# Altium project YL-LPC4350-CORE-V1.0 .PRJPCB
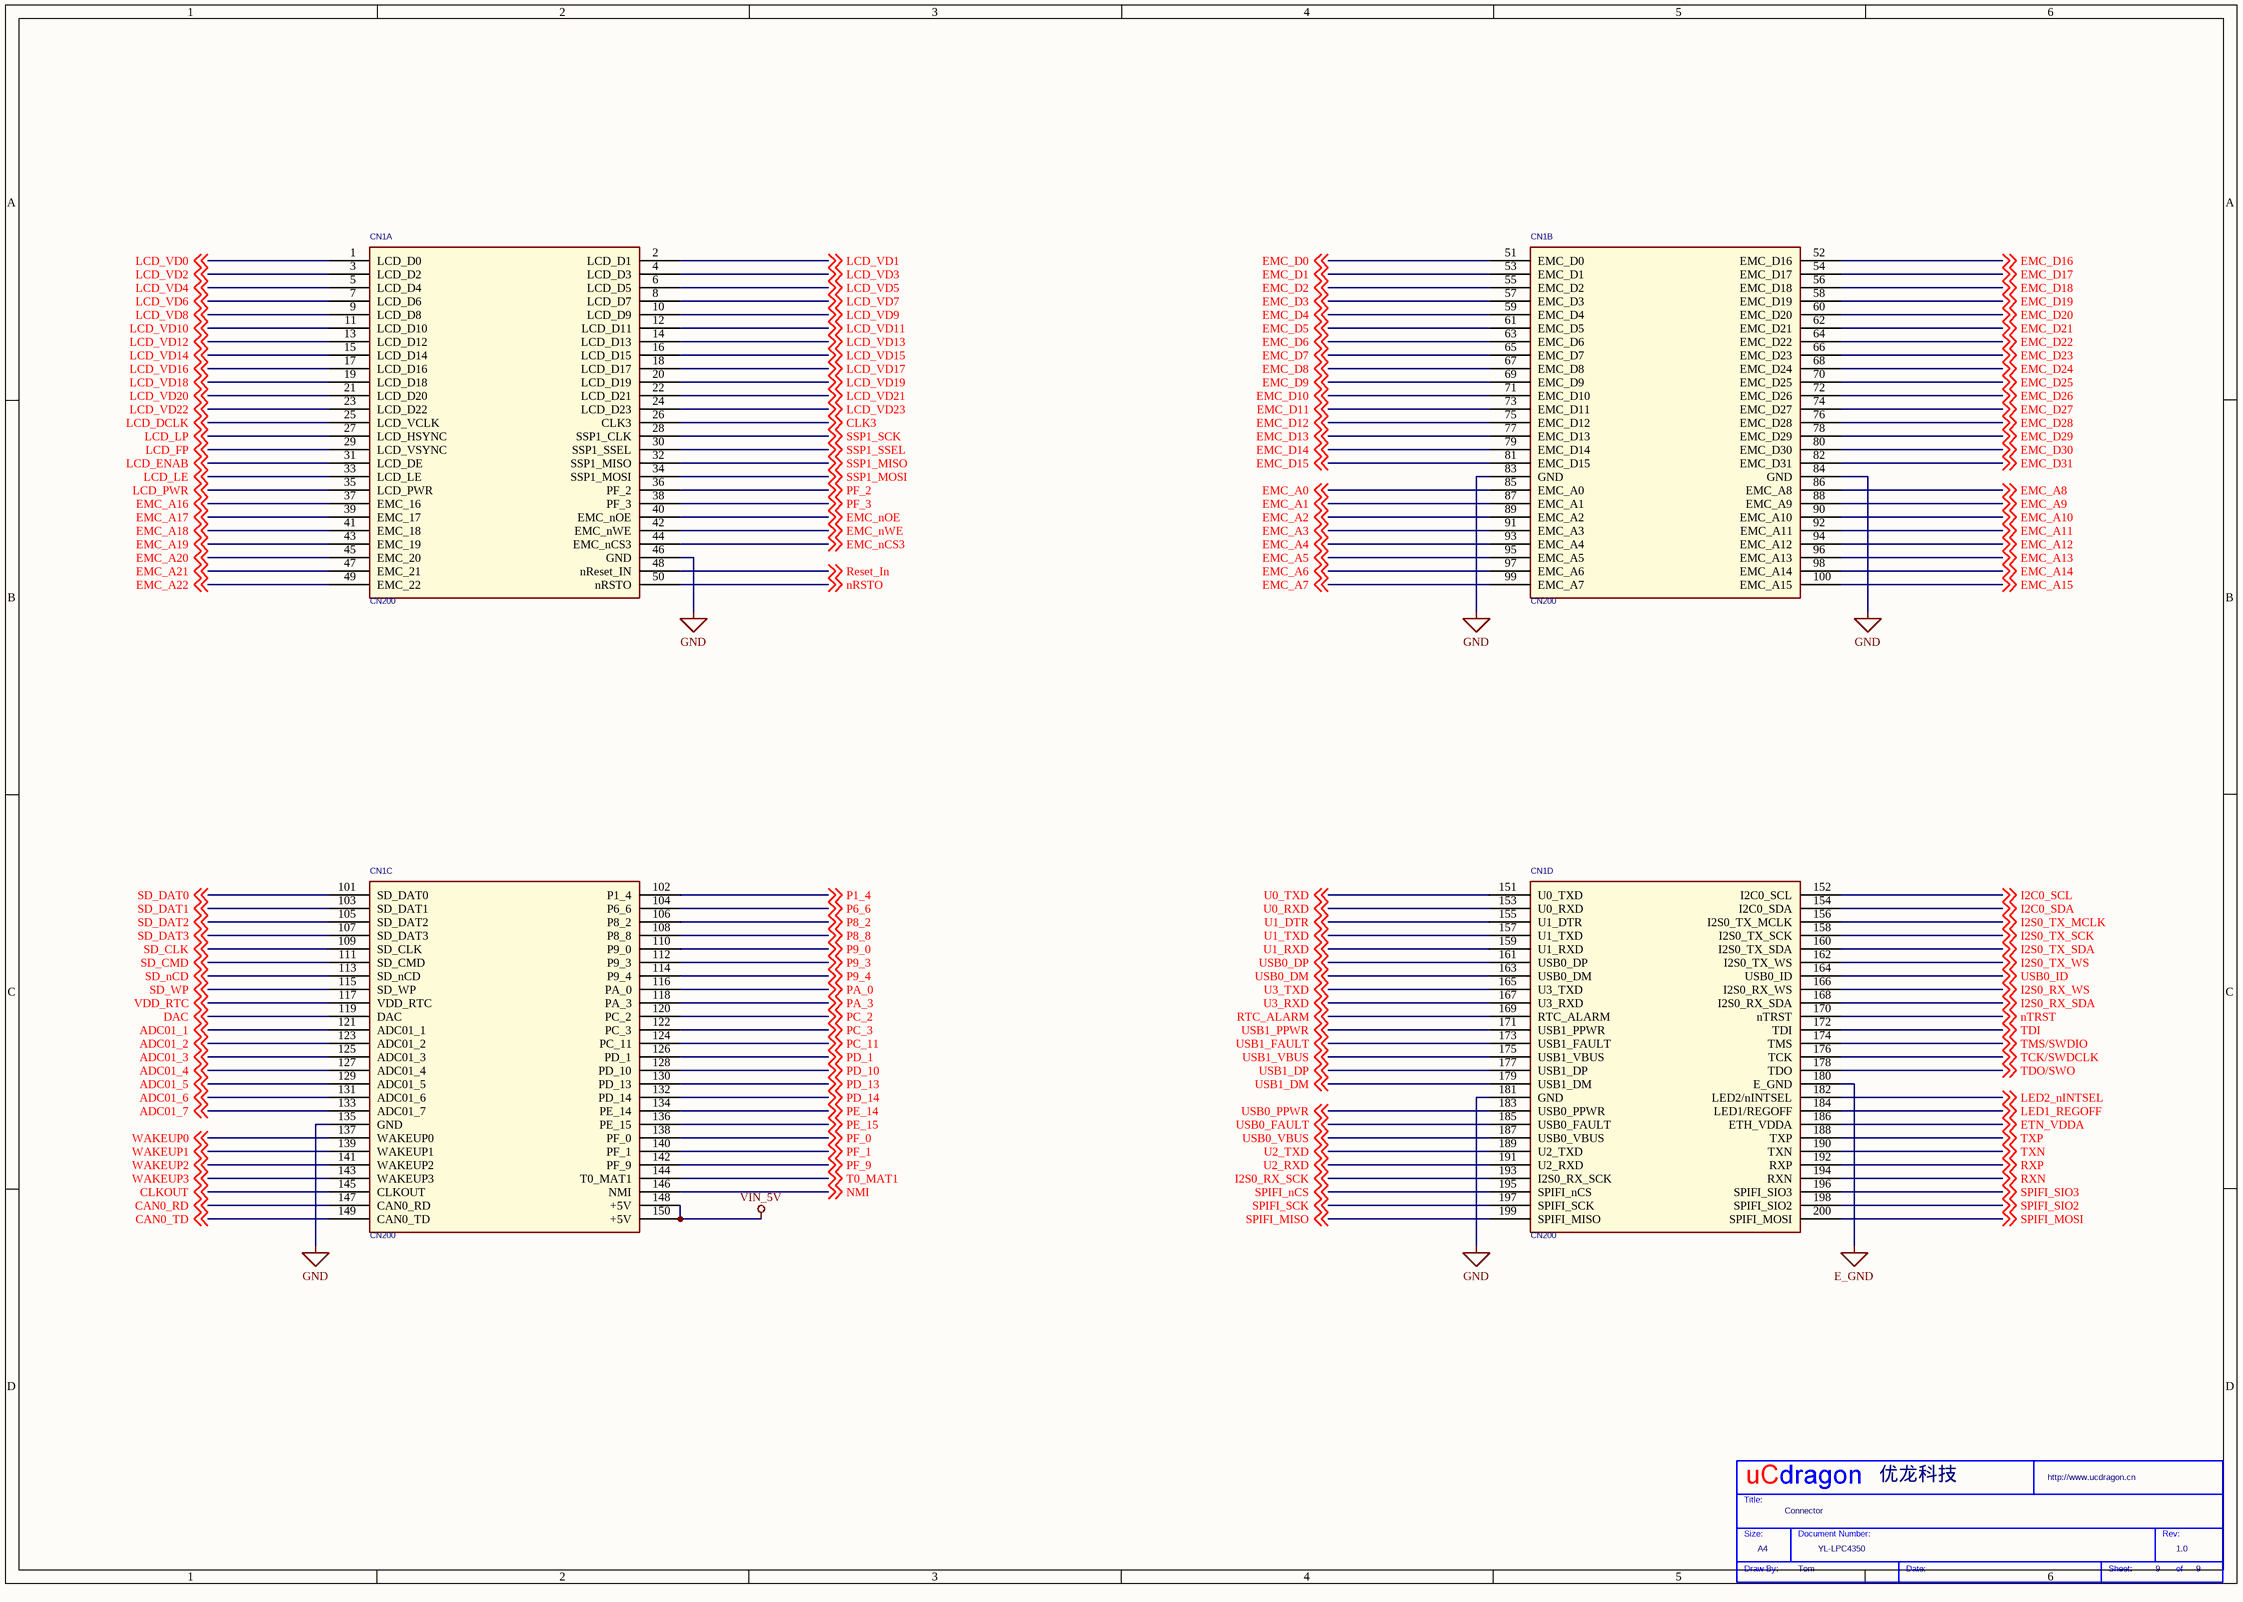
[diagram p0: 9) Connector.SchDoc]
5 sheets, 101 parts. Net scope: global (net labels, ports and power ports of the same name join across sheets).
Sheets:
  9) Connector.SchDoc
  8) Power Supply,Config.SchDoc
  7) EMAC.SchDoc
  6) Nand Flash,NOR Flash.SchDoc
  5) 64MB SDRAM.SchDoc

## Sheet 9) Connector.SchDoc
size 420 x 297 mm

### Parts
(Parts that share a designator on the sheet are numbered #1, #2 ... from top to bottom, then left to right.)
*#1  Company: 优龙科技  Drawing: Tom  Doc: YL-LPC4350  RevCode: 1.0  Title: Connector  Page Size: A4  Page Number: 9  (hidden comment: My Title 0)  (graphical)
CN1  CN200  [DIP-4X50PIN]  (parts A,B,C,D of 4)

### Nets
E_GND: CN1.180(E_GND)
GND: CN1.46(GND) CN1.83(GND) CN1.84(GND) CN1.135(GND) CN1.181(GND)
VIN_5V: CN1.148(+5V) CN1.150(+5V)
ADC01_1: CN1.121(ADC01_1) ; off-sheet ADC01_1
ADC01_2: CN1.123(ADC01_2) ; off-sheet ADC01_2
ADC01_3: CN1.125(ADC01_3) ; off-sheet ADC01_3
ADC01_4: CN1.127(ADC01_4) ; off-sheet ADC01_4
ADC01_5: CN1.129(ADC01_5) ; off-sheet ADC01_5
ADC01_6: CN1.131(ADC01_6) ; off-sheet ADC01_6
ADC01_7: CN1.133(ADC01_7) ; off-sheet ADC01_7
CAN0_RD: CN1.147(CAN0_RD) ; off-sheet CAN0_RD
CAN0_TD: CN1.149(CAN0_TD) ; off-sheet CAN0_TD
CLK3: CN1.26(CLK3) ; off-sheet CLK3
CLKOUT: CN1.145(CLKOUT) ; off-sheet CLKOUT
DAC: CN1.119(DAC) ; off-sheet DAC
EMC_A0: CN1.85(EMC_A0) ; off-sheet EMC_A0
EMC_A1: CN1.87(EMC_A1) ; off-sheet EMC_A1
EMC_A2: CN1.89(EMC_A2) ; off-sheet EMC_A2
EMC_A3: CN1.91(EMC_A3) ; off-sheet EMC_A3
EMC_A4: CN1.93(EMC_A4) ; off-sheet EMC_A4
EMC_A5: CN1.95(EMC_A5) ; off-sheet EMC_A5
EMC_A6: CN1.97(EMC_A6) ; off-sheet EMC_A6
EMC_A7: CN1.99(EMC_A7) ; off-sheet EMC_A7
EMC_A8: CN1.86(EMC_A8) ; off-sheet EMC_A8
EMC_A9: CN1.88(EMC_A9) ; off-sheet EMC_A9
EMC_A10: CN1.90(EMC_A10) ; off-sheet EMC_A10
EMC_A11: CN1.92(EMC_A11) ; off-sheet EMC_A11
EMC_A12: CN1.94(EMC_A12) ; off-sheet EMC_A12
EMC_A13: CN1.96(EMC_A13) ; off-sheet EMC_A13
EMC_A14: CN1.98(EMC_A14) ; off-sheet EMC_A14
EMC_A15: CN1.100(EMC_A15) ; off-sheet EMC_A15
EMC_A16: CN1.37(EMC_16) ; off-sheet EMC_A16
EMC_A17: CN1.39(EMC_17) ; off-sheet EMC_A17
EMC_A18: CN1.41(EMC_18) ; off-sheet EMC_A18
EMC_A19: CN1.43(EMC_19) ; off-sheet EMC_A19
EMC_A20: CN1.45(EMC_20) ; off-sheet EMC_A20
EMC_A21: CN1.47(EMC_21) ; off-sheet EMC_A21
EMC_A22: CN1.49(EMC_22) ; off-sheet EMC_A22
EMC_D0: CN1.51(EMC_D0) ; off-sheet EMC_D0
EMC_D1: CN1.53(EMC_D1) ; off-sheet EMC_D1
EMC_D2: CN1.55(EMC_D2) ; off-sheet EMC_D2
EMC_D3: CN1.57(EMC_D3) ; off-sheet EMC_D3
EMC_D4: CN1.59(EMC_D4) ; off-sheet EMC_D4
EMC_D5: CN1.61(EMC_D5) ; off-sheet EMC_D5
EMC_D6: CN1.63(EMC_D6) ; off-sheet EMC_D6
EMC_D7: CN1.65(EMC_D7) ; off-sheet EMC_D7
EMC_D8: CN1.67(EMC_D8) ; off-sheet EMC_D8
EMC_D9: CN1.69(EMC_D9) ; off-sheet EMC_D9
EMC_D10: CN1.71(EMC_D10) ; off-sheet EMC_D10
EMC_D11: CN1.73(EMC_D11) ; off-sheet EMC_D11
EMC_D12: CN1.75(EMC_D12) ; off-sheet EMC_D12
EMC_D13: CN1.77(EMC_D13) ; off-sheet EMC_D13
EMC_D14: CN1.79(EMC_D14) ; off-sheet EMC_D14
EMC_D15: CN1.81(EMC_D15) ; off-sheet EMC_D15
EMC_D16: CN1.52(EMC_D16) ; off-sheet EMC_D16
EMC_D17: CN1.54(EMC_D17) ; off-sheet EMC_D17
EMC_D18: CN1.56(EMC_D18) ; off-sheet EMC_D18
EMC_D19: CN1.58(EMC_D19) ; off-sheet EMC_D19
EMC_D20: CN1.60(EMC_D20) ; off-sheet EMC_D20
EMC_D21: CN1.62(EMC_D21) ; off-sheet EMC_D21
EMC_D22: CN1.64(EMC_D22) ; off-sheet EMC_D22
EMC_D23: CN1.66(EMC_D23) ; off-sheet EMC_D23
EMC_D24: CN1.68(EMC_D24) ; off-sheet EMC_D24
EMC_D25: CN1.70(EMC_D25) ; off-sheet EMC_D25
EMC_D26: CN1.72(EMC_D26) ; off-sheet EMC_D26
EMC_D27: CN1.74(EMC_D27) ; off-sheet EMC_D27
EMC_D28: CN1.76(EMC_D28) ; off-sheet EMC_D28
EMC_D29: CN1.78(EMC_D29) ; off-sheet EMC_D29
EMC_D30: CN1.80(EMC_D30) ; off-sheet EMC_D30
EMC_D31: CN1.82(EMC_D31) ; off-sheet EMC_D31
EMC_nCS3: CN1.44(EMC_nCS3) ; off-sheet EMC_nCS3
EMC_nOE: CN1.40(EMC_nOE) ; off-sheet EMC_nOE
EMC_nWE: CN1.42(EMC_nWE) ; off-sheet EMC_nWE
ETN_VDDA: CN1.186(ETH_VDDA) ; off-sheet ETN_VDDA
I2C0_SCL: CN1.152(I2C0_SCL) ; off-sheet I2C0_SCL
I2C0_SDA: CN1.154(I2C0_SDA) ; off-sheet I2C0_SDA
I2S0_RX_SCK: CN1.193(I2S0_RX_SCK) ; off-sheet I2S0_RX_SCK
I2S0_RX_SDA: CN1.168(I2S0_RX_SDA) ; off-sheet I2S0_RX_SDA
I2S0_RX_WS: CN1.166(I2S0_RX_WS) ; off-sheet I2S0_RX_WS
I2S0_TX_MCLK: CN1.156(I2S0_TX_MCLK) ; off-sheet I2S0_TX_MCLK
I2S0_TX_SCK: CN1.158(I2S0_TX_SCK) ; off-sheet I2S0_TX_SCK
I2S0_TX_SDA: CN1.160(I2S0_TX_SDA) ; off-sheet I2S0_TX_SDA
I2S0_TX_WS: CN1.162(I2S0_TX_WS) ; off-sheet I2S0_TX_WS
LCD_DCLK: CN1.25(LCD_VCLK) ; off-sheet LCD_DCLK
LCD_ENAB: CN1.31(LCD_DE) ; off-sheet LCD_ENAB
LCD_FP: CN1.29(LCD_VSYNC) ; off-sheet LCD_FP
LCD_LE: CN1.33(LCD_LE) ; off-sheet LCD_LE
LCD_LP: CN1.27(LCD_HSYNC) ; off-sheet LCD_LP
LCD_PWR: CN1.35(LCD_PWR) ; off-sheet LCD_PWR
LCD_VD0: CN1.1(LCD_D0) ; off-sheet LCD_VD0
LCD_VD1: CN1.2(LCD_D1) ; off-sheet LCD_VD1
LCD_VD2: CN1.3(LCD_D2) ; off-sheet LCD_VD2
LCD_VD3: CN1.4(LCD_D3) ; off-sheet LCD_VD3
LCD_VD4: CN1.5(LCD_D4) ; off-sheet LCD_VD4
LCD_VD5: CN1.6(LCD_D5) ; off-sheet LCD_VD5
LCD_VD6: CN1.7(LCD_D6) ; off-sheet LCD_VD6
LCD_VD7: CN1.8(LCD_D7) ; off-sheet LCD_VD7
LCD_VD8: CN1.9(LCD_D8) ; off-sheet LCD_VD8
LCD_VD9: CN1.10(LCD_D9) ; off-sheet LCD_VD9
LCD_VD10: CN1.11(LCD_D10) ; off-sheet LCD_VD10
LCD_VD11: CN1.12(LCD_D11) ; off-sheet LCD_VD11
LCD_VD12: CN1.13(LCD_D12) ; off-sheet LCD_VD12
LCD_VD13: CN1.14(LCD_D13) ; off-sheet LCD_VD13
LCD_VD14: CN1.15(LCD_D14) ; off-sheet LCD_VD14
LCD_VD15: CN1.16(LCD_D15) ; off-sheet LCD_VD15
LCD_VD16: CN1.17(LCD_D16) ; off-sheet LCD_VD16
LCD_VD17: CN1.18(LCD_D17) ; off-sheet LCD_VD17
LCD_VD18: CN1.19(LCD_D18) ; off-sheet LCD_VD18
LCD_VD19: CN1.20(LCD_D19) ; off-sheet LCD_VD19
LCD_VD20: CN1.21(LCD_D20) ; off-sheet LCD_VD20
LCD_VD21: CN1.22(LCD_D21) ; off-sheet LCD_VD21
LCD_VD22: CN1.23(LCD_D22) ; off-sheet LCD_VD22
LCD_VD23: CN1.24(LCD_D23) ; off-sheet LCD_VD23
LED1_REGOFF: CN1.184(LED1/REGOFF) ; off-sheet LED1_REGOFF
LED2_nINTSEL: CN1.182(LED2/nINTSEL) ; off-sheet LED2_nINTSEL
NMI: CN1.146(NMI) ; off-sheet NMI
nRSTO: CN1.50(nRSTO) ; off-sheet nRSTO
nTRST: CN1.170(nTRST) ; off-sheet nTRST
P1_4: CN1.102(P1_4) ; off-sheet P1_4
P6_6: CN1.104(P6_6) ; off-sheet P6_6
P8_2: CN1.106(P8_2) ; off-sheet P8_2
P8_8: CN1.108(P8_8) ; off-sheet P8_8
P9_0: CN1.110(P9_0) ; off-sheet P9_0
P9_3: CN1.112(P9_3) ; off-sheet P9_3
P9_4: CN1.114(P9_4) ; off-sheet P9_4
PA_0: CN1.116(PA_0) ; off-sheet PA_0
PA_3: CN1.118(PA_3) ; off-sheet PA_3
PC_2: CN1.120(PC_2) ; off-sheet PC_2
PC_3: CN1.122(PC_3) ; off-sheet PC_3
PC_11: CN1.124(PC_11) ; off-sheet PC_11
PD_1: CN1.126(PD_1) ; off-sheet PD_1
PD_10: CN1.128(PD_10) ; off-sheet PD_10
PD_13: CN1.130(PD_13) ; off-sheet PD_13
PD_14: CN1.132(PD_14) ; off-sheet PD_14
PE_14: CN1.134(PE_14) ; off-sheet PE_14
PE_15: CN1.136(PE_15) ; off-sheet PE_15
PF_0: CN1.138(PF_0) ; off-sheet PF_0
PF_1: CN1.140(PF_1) ; off-sheet PF_1
PF_2: CN1.36(PF_2) ; off-sheet PF_2
PF_3: CN1.38(PF_3) ; off-sheet PF_3
PF_9: CN1.142(PF_9) ; off-sheet PF_9
Reset_In: CN1.48(nReset_IN) ; off-sheet Reset_In
RTC_ALARM: CN1.169(RTC_ALARM) ; off-sheet RTC_ALARM
RXN: CN1.194(RXN) ; off-sheet RXN
RXP: CN1.192(RXP) ; off-sheet RXP
SD_CLK: CN1.109(SD_CLK) ; off-sheet SD_CLK
SD_CMD: CN1.111(SD_CMD) ; off-sheet SD_CMD
SD_DAT0: CN1.101(SD_DAT0) ; off-sheet SD_DAT0
SD_DAT1: CN1.103(SD_DAT1) ; off-sheet SD_DAT1
SD_DAT2: CN1.105(SD_DAT2) ; off-sheet SD_DAT2
SD_DAT3: CN1.107(SD_DAT3) ; off-sheet SD_DAT3
SD_nCD: CN1.113(SD_nCD) ; off-sheet SD_nCD
SD_WP: CN1.115(SD_WP) ; off-sheet SD_WP
SPIFI_MISO: CN1.199(SPIFI_MISO) ; off-sheet SPIFI_MISO
SPIFI_MOSI: CN1.200(SPIFI_MOSI) ; off-sheet SPIFI_MOSI
SPIFI_nCS: CN1.195(SPIFI_nCS) ; off-sheet SPIFI_nCS
SPIFI_SCK: CN1.197(SPIFI_SCK) ; off-sheet SPIFI_SCK
SPIFI_SIO2: CN1.198(SPIFI_SIO2) ; off-sheet SPIFI_SIO2
SPIFI_SIO3: CN1.196(SPIFI_SIO3) ; off-sheet SPIFI_SIO3
SSP1_MISO: CN1.32(SSP1_MISO) ; off-sheet SSP1_MISO
SSP1_MOSI: CN1.34(SSP1_MOSI) ; off-sheet SSP1_MOSI
SSP1_SCK: CN1.28(SSP1_CLK) ; off-sheet SSP1_SCK
SSP1_SSEL: CN1.30(SSP1_SSEL) ; off-sheet SSP1_SSEL
T0_MAT1: CN1.144(T0_MAT1) ; off-sheet T0_MAT1
TCK/SWDCLK: CN1.176(TCK) ; off-sheet TCK/SWDCLK
TDI: CN1.172(TDI) ; off-sheet TDI
TDO/SWO: CN1.178(TDO) ; off-sheet TDO/SWO
TMS/SWDIO: CN1.174(TMS) ; off-sheet TMS/SWDIO
TXN: CN1.190(TXN) ; off-sheet TXN
TXP: CN1.188(TXP) ; off-sheet TXP
U0_RXD: CN1.153(U0_RXD) ; off-sheet U0_RXD
U0_TXD: CN1.151(U0_TXD) ; off-sheet U0_TXD
U1_DTR: CN1.155(U1_DTR) ; off-sheet U1_DTR
U1_RXD: CN1.159(U1_RXD) ; off-sheet U1_RXD
U1_TXD: CN1.157(U1_TXD) ; off-sheet U1_TXD
U2_RXD: CN1.191(U2_RXD) ; off-sheet U2_RXD
U2_TXD: CN1.189(U2_TXD) ; off-sheet U2_TXD
U3_RXD: CN1.167(U3_RXD) ; off-sheet U3_RXD
U3_TXD: CN1.165(U3_TXD) ; off-sheet U3_TXD
USB0_DM: CN1.163(USB0_DM) ; off-sheet USB0_DM
USB0_DP: CN1.161(USB0_DP) ; off-sheet USB0_DP
USB0_FAULT: CN1.185(USB0_FAULT) ; off-sheet USB0_FAULT
USB0_ID: CN1.164(USB0_ID) ; off-sheet USB0_ID
USB0_PPWR: CN1.183(USB0_PPWR) ; off-sheet USB0_PPWR
USB0_VBUS: CN1.187(USB0_VBUS) ; off-sheet USB0_VBUS
USB1_DM: CN1.179(USB1_DM) ; off-sheet USB1_DM
USB1_DP: CN1.177(USB1_DP) ; off-sheet USB1_DP
USB1_FAULT: CN1.173(USB1_FAULT) ; off-sheet USB1_FAULT
USB1_PPWR: CN1.171(USB1_PPWR) ; off-sheet USB1_PPWR
USB1_VBUS: CN1.175(USB1_VBUS) ; off-sheet USB1_VBUS
VDD_RTC: CN1.117(VDD_RTC) ; off-sheet VDD_RTC
WAKEUP0: CN1.137(WAKEUP0) ; off-sheet WAKEUP0
WAKEUP1: CN1.139(WAKEUP1) ; off-sheet WAKEUP1
WAKEUP2: CN1.141(WAKEUP2) ; off-sheet WAKEUP2
WAKEUP3: CN1.143(WAKEUP3) ; off-sheet WAKEUP3

### Notes on the sheet
- (in symbol My Title 0) Title:; Size:; Document Number:; Rev:; Draw By:; Date:; Sheet:; of

### Library data of the parts
*#1 = My Title 0: WebSite: http://www.ucdragon.cn; Page Create Date: May 29, 2006; Page Count: 9

## Sheet 8) Power Supply,Config.SchDoc
size 420 x 297 mm
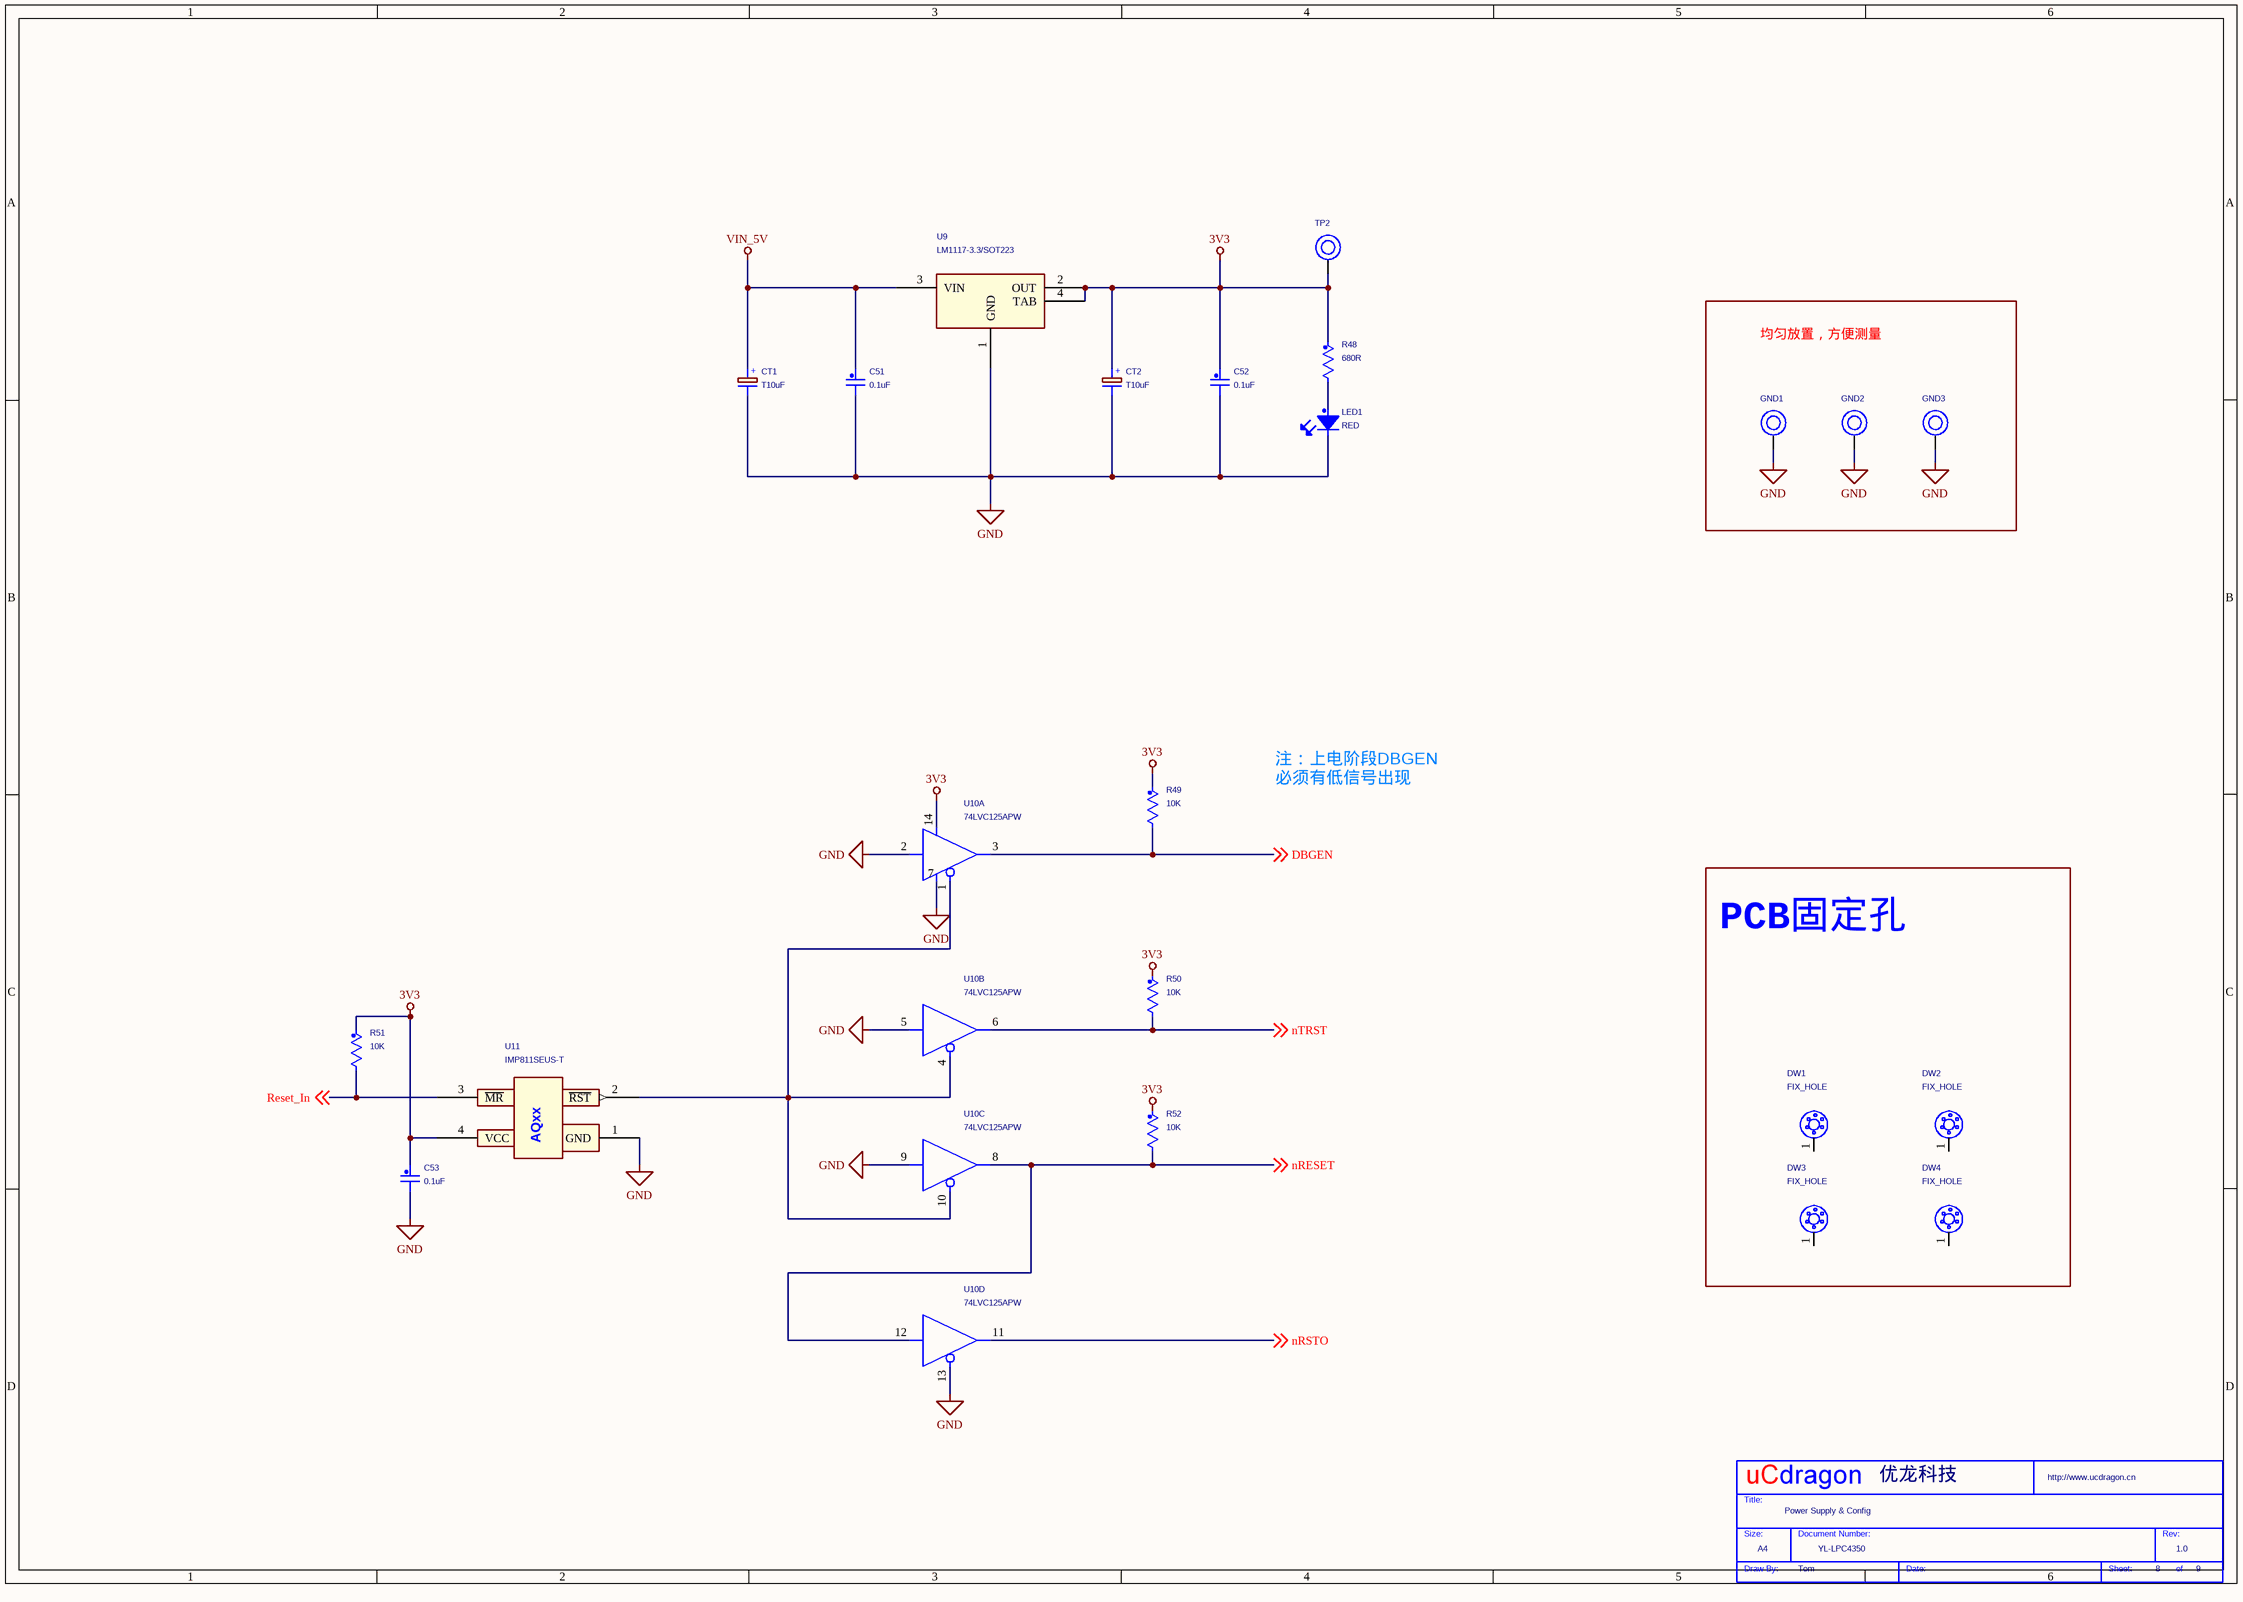
[diagram p1: 8) Power Supply,Config.SchDoc]

### Parts
(Parts that share a designator on the sheet are numbered #1, #2 ... from top to bottom, then left to right.)
*#2  Company: 优龙科技  Drawing: Tom  Doc: YL-LPC4350  RevCode: 1.0  Title: Power Supply & Config  Page Size: A4  Page Number: 8  Page Count: 9  (hidden comment: My Title 0)  (graphical)
C51  0.1uF  [CAP0805]
C52  0.1uF  [CAP0805]
C53  0.1uF  [CAP0805]
CT1  T10uF  [TAN-A]
CT2  T10uF  [TAN-A]
DW1  FIX_HOLE  [FULCRUM2]
DW2  FIX_HOLE  [FULCRUM2]
DW3  FIX_HOLE  [FULCRUM2]
DW4  FIX_HOLE  [FULCRUM2]
GND1  GND  [XP-TP-H0.8MM]  (value not drawn)
GND2  GND  [XP-TP-H0.8MM]  (value not drawn)
GND3  GND  [XP-TP-H0.8MM]  (value not drawn)
LED1  RED  [LED0603]
R48  680R  [R0603]
R49  10K  [R0603]
R50  10K  [R0603]
R51  10K  [R0603]
R52  10K  [R0603]
TP2  3.3V  [XP-TP-H0.8MM]  (value not drawn)
U9  LM1117-3.3/SOT223  [XP-SOT223-3]
U10  74LVC125APW  [74LVC125APW_TSSOP14]  (parts A,B,C,D of 4)
U11  IMP811SEUS-T  [SOT143A]

### Blocks framed on the sheet
均匀放置，方便测量: GND1-GND3
PCB固定孔: DW1-DW4

### Nets
3V3: C52.1 C53.1 CT2.1 R48.1 R49.1 R50.1 R51.1 R52.1 TP2.1 U9.2(OUT) U9.4(TAB) U10.14(VCC) U11.4(VCC)
GND: C51.2 C52.2 C53.2 CT1.2 CT2.2 GND1.1 GND2.1 GND3.1 LED1.2 U9.1(GND) U10.2(A) U10.5(A) U10.7(GND) U10.9(A) U10.13(OE) U11.1(GND)
VIN_5V: C51.1 CT1.1 U9.3(VIN)
DBGEN: R49.2 U10.3(Y) ; off-sheet DBGEN
nRESET: R52.2 U10.8(Y) U10.12(A) ; off-sheet nRESET
nRSTO: U10.11(Y) ; off-sheet nRSTO
nTRST: R50.2 U10.6(Y) ; off-sheet nTRST
Reset_In: R51.2 U11.3(~{MR}) ; off-sheet Reset_In
NetLED1_1: LED1.1 R48.2
NetU10_1: U10.1(OE) U10.4(OE) U10.10(OE) U11.2(~{RST})

Not connected (* = marked no-connect by the designer): DW1 1; DW2 1; DW3 1; DW4 1

### Notes on the sheet
- 注：上电阶段DBGEN
  必须有低信号出现
- (in symbol CAP PN) +
- (in symbol IMP811SEUS-T) AQxx
- (in symbol My Title 0) Title:; Size:; Document Number:; Rev:; Draw By:; Date:; Sheet:; of

### Library data of the parts
C51-C53 = C_Generic: Toler.: 10%; P/N #1: C0603C104K4RAC; Voltage: 16V; Mfg #1: KEMET; Dielectric: X7R
CT1 CT2 = CAP PN: SDTSourceLibName: C:\WINDOWS\TEMP\SNDS.LIB
GND1-GND3 TP2 = TestPoint-HOLE
LED1 = LED Marking Pin 1
R48-R52 = R_Generic_Dup2
U9 = LM1117 SOT223
U10 = 74HC125
*#2 = My Title 0: WebSite: http://www.ucdragon.cn; Page Create Date: May 29, 2006

## Sheet 7) EMAC.SchDoc
size 420 x 297 mm
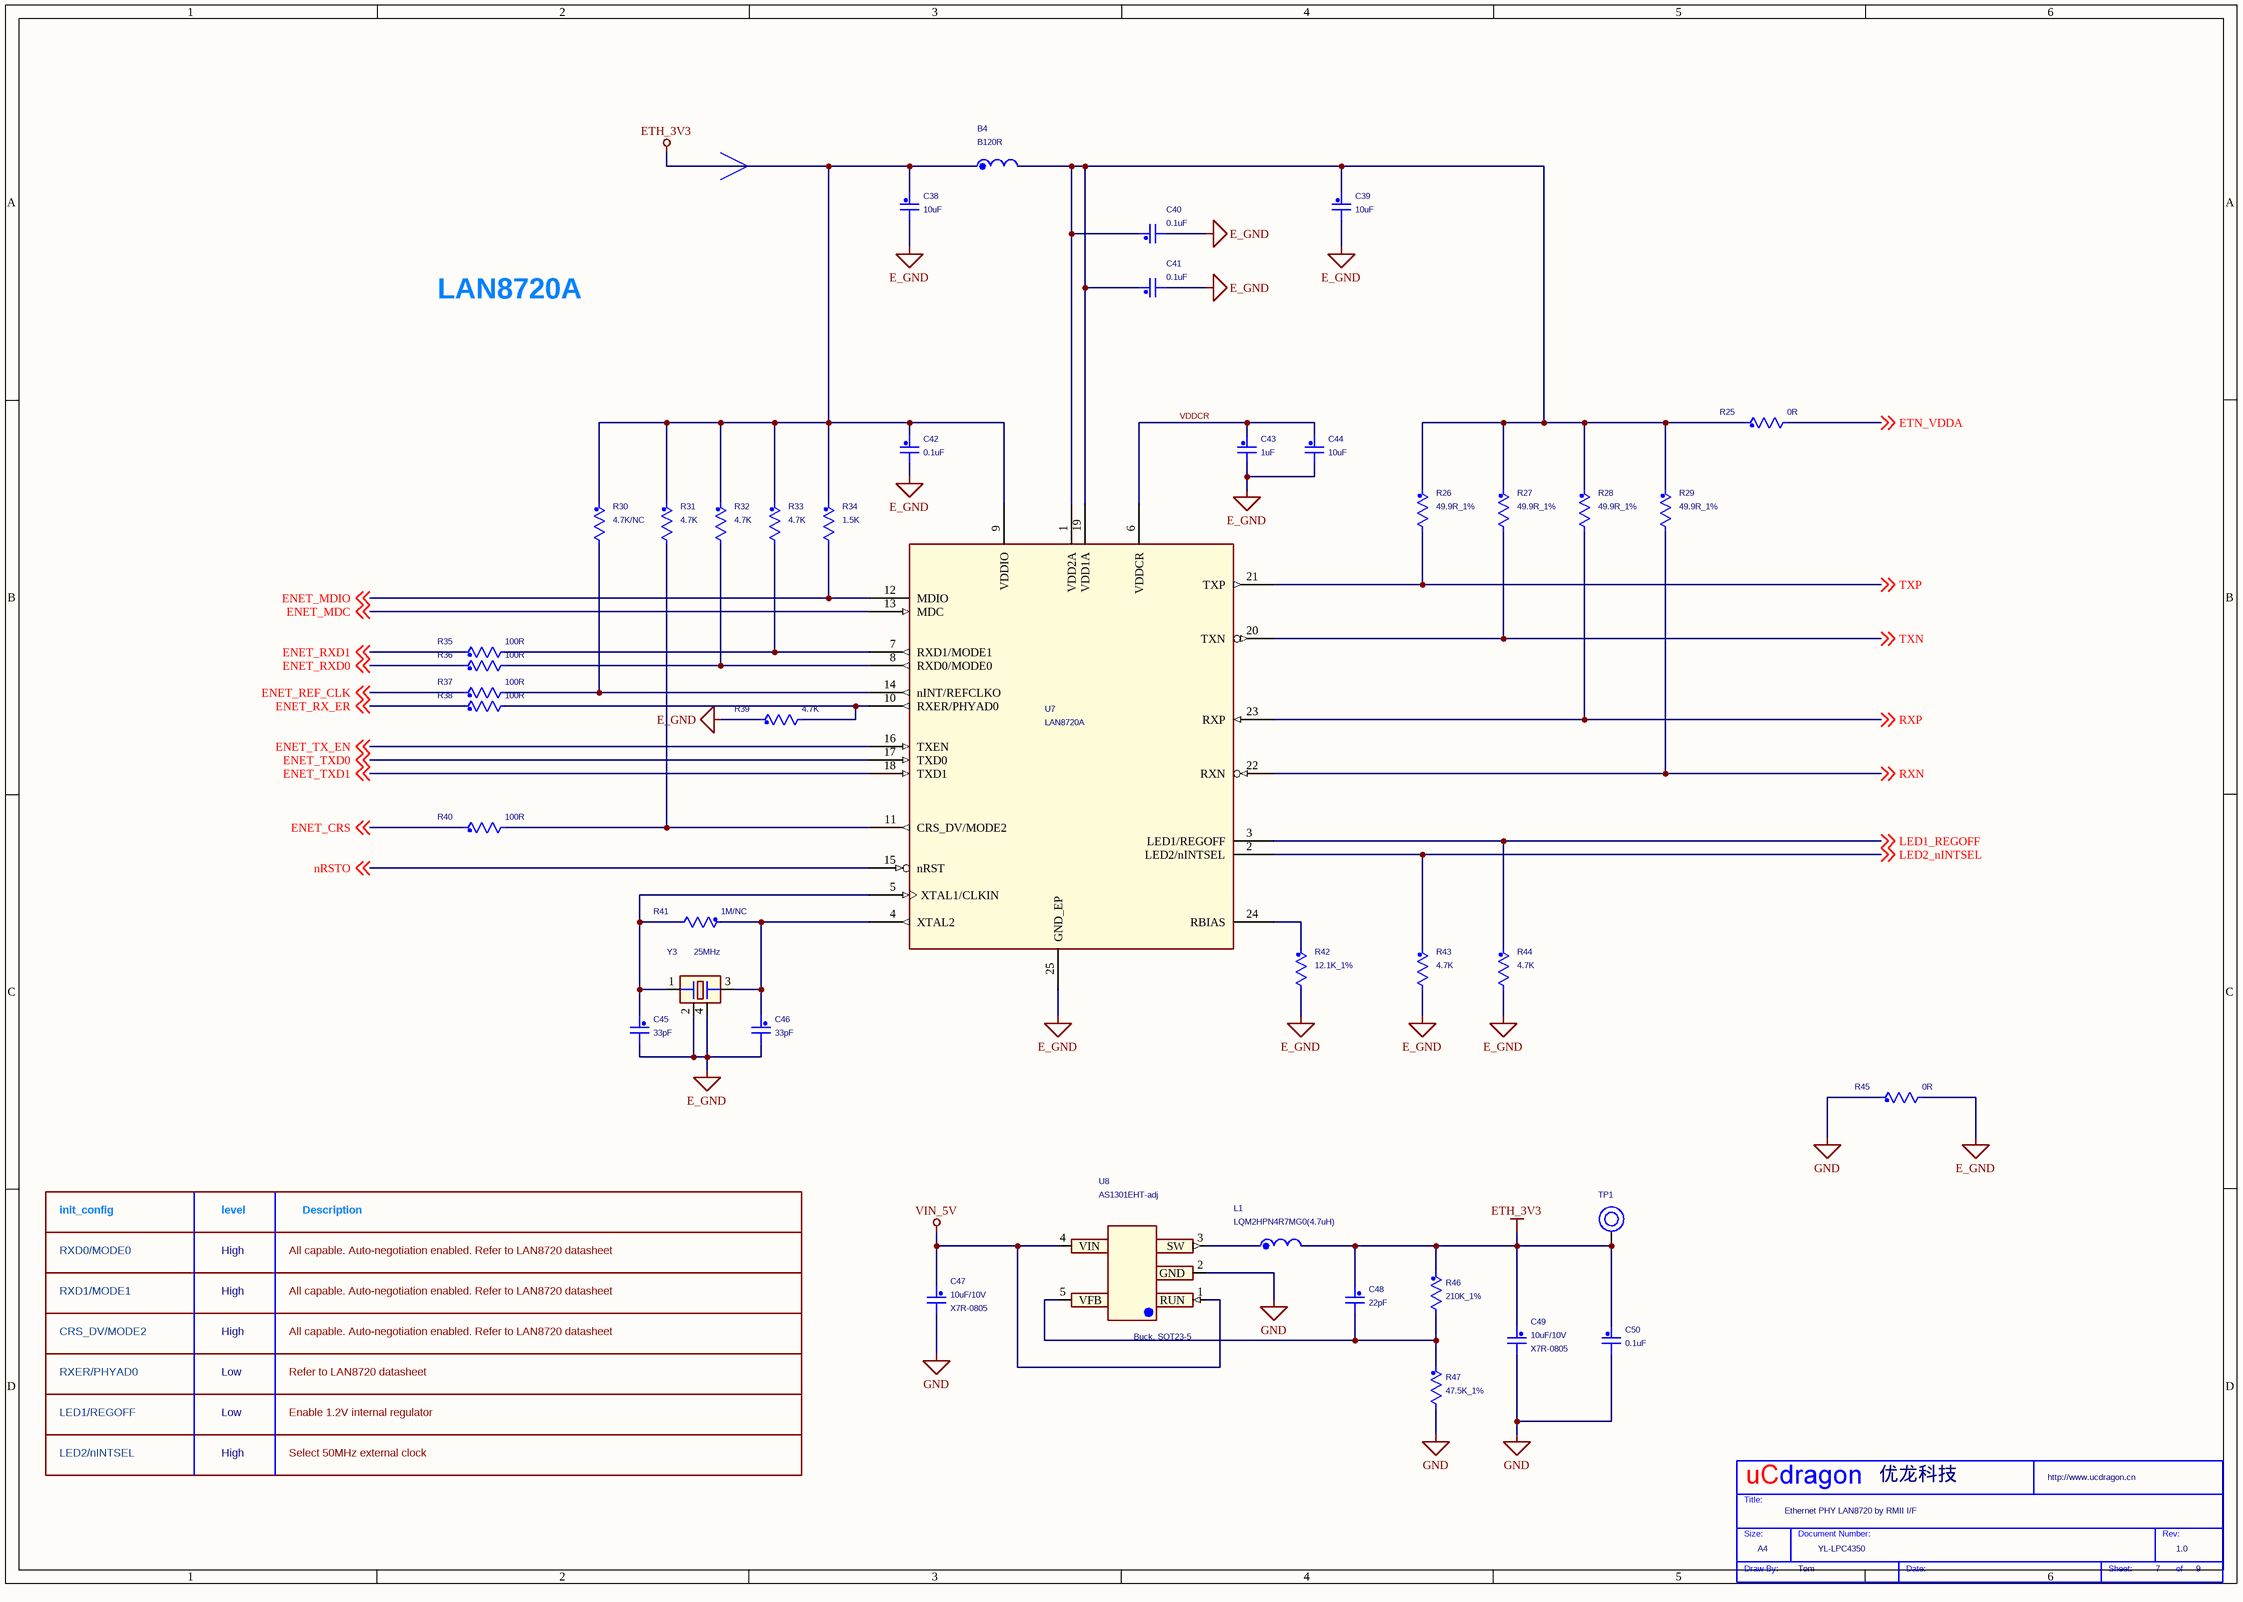
[diagram p2: 7) EMAC.SchDoc]

### Parts
(Parts that share a designator on the sheet are numbered #1, #2 ... from top to bottom, then left to right.)
*#3  Company: 优龙科技  Drawing: Tom  Doc: YL-LPC4350  RevCode: 1.0  Title: Ethernet PHY LAN8720 by RMII I/F  Page Size: A4  Page Number: 7  Page Count: 9  (hidden comment: My Title 0)  (graphical)
B4  B120R  [R0603]
C38  10uF  [CAP0805]
C39  10uF  [CAP0805]
C40  0.1uF  [CAP0805]
C41  0.1uF  [CAP0805]
C42  0.1uF  [CAP0805]
C43  1uF  [CAP0805]
C44  10uF  [CAP0805]
C45  33pF  [CAP0805]
C46  33pF  [CAP0805]
C47  10uF/10V  Note: X7R-0805  [CAP0805]
C48  22pF  [CAP0805]
C49  10uF/10V  Note: X7R-0805  [CAP0805]
C50  0.1uF  [CAP0805]
L1  LQM2HPN4R7MG0(4.7uH)  [L2.5X1.5]
R25  0R  [R0603]
R26  49.9R_1%  [R0603]
R27  49.9R_1%  [R0603]
R28  49.9R_1%  [R0603]
R29  49.9R_1%  [R0603]
R30  4.7K/NC  [R0603]
R31  4.7K  [R0603]
R32  4.7K  [R0603]
R33  4.7K  [R0603]
R34  1.5K  [R0603]
R35  100R  [R0603]
R36  100R  [R0603]
R37  100R  [R0603]
R38  100R  [R0603]
R39  4.7K  [R0603]
R40  100R  [R0603]
R41  1M/NC  [R0603]
R42  12.1K_1%  [R0603]
R43  4.7K  [R0603]
R44  4.7K  [R0603]
R45  0R  [R0805]
R46  210K_1%  [R0402]
R47  47.5K_1%  [R0402]
TP1  3.3V  [XP-TP-H0.8MM]  (value not drawn)
U7  LAN8720A  [QFN24_4X4MM_EP2P5MM]
U8  AS1301EHT-adj  Note: Buck, SOT23-5  [SOT23-5]
Y3  25MHz  [XTAL3.2X2.5]

### Nets
E_GND: C38.2 C39.2 C40.2 C41.2 C42.2 C43.2 C44.2 C45.2 C46.2 R39.1 R42.2 R43.2 R44.2 R45.2 U7.25(GND_EP) Y3.2(NC) Y3.4(NC)
ETH_3V3: B4.1 C38.1 C42.1 C48.1 C49.1 C50.1 L1.2 R30.1 R31.1 R32.1 R33.1 R34.1 R46.1 TP1.1 U7.9(VDDIO)
GND: C47.2 C49.2 C50.2 R45.1 R47.2 U8.2(GND)
VIN_5V: C47.1 U8.1(RUN) U8.4(VIN)
ENET_CRS: R40.1 ; off-sheet ENET_CRS
ENET_MDC: U7.13(MDC) ; off-sheet ENET_MDC
ENET_MDIO: R34.2 U7.12(MDIO) ; off-sheet ENET_MDIO
ENET_REF_CLK: R37.1 ; off-sheet ENET_REF_CLK
ENET_RX_ER: R38.1 ; off-sheet ENET_RX_ER
ENET_RXD0: R36.1 ; off-sheet ENET_RXD0
ENET_RXD1: R35.1 ; off-sheet ENET_RXD1
ENET_TX_EN: U7.16(TXEN) ; off-sheet ENET_TX_EN
ENET_TXD0: U7.17(TXD0) ; off-sheet ENET_TXD0
ENET_TXD1: U7.18(TXD1) ; off-sheet ENET_TXD1
ETN_VDDA: R25.2 ; off-sheet ETN_VDDA
LED1_REGOFF: R44.1 U7.3(LED1/REGOFF) ; off-sheet LED1_REGOFF
LED2_nINTSEL: R43.1 U7.2(LED2/nINTSEL) ; off-sheet LED2_nINTSEL
nRSTO: U7.15(nRST) ; off-sheet nRSTO
RXN: R29.2 U7.22(RXN) ; off-sheet RXN
RXP: R28.2 U7.23(RXP) ; off-sheet RXP
TXN: R27.2 U7.20(TXN) ; off-sheet TXN
TXP: R26.2 U7.21(TXP) ; off-sheet TXP
VDDCR: C43.1 C44.1 U7.6(VDDCR)
NetB4_2: B4.2 C39.1 C40.1 C41.1 R25.1 R26.1 R27.1 R28.1 R29.1 U7.1(VDD2A) U7.19(VDD1A)
NetC45_1: C45.1 R41.2 U7.5(XTAL1/CLKIN) Y3.1
NetC46_1: C46.1 R41.1 U7.4(XTAL2) Y3.3
NetC48_2: C48.2 R46.2 R47.1 U8.5(VFB)
NetL1_1: L1.1 U8.3(SW)
NetR30_2: R30.2 R37.2 U7.14(nINT/REFCLKO)
NetR31_2: R31.2 R40.2 U7.11(CRS_DV/MODE2)
NetR32_2: R32.2 R36.2 U7.8(RXD0/MODE0)
NetR33_2: R33.2 R35.2 U7.7(RXD1/MODE1)
NetR38_2: R38.2 R39.2 U7.10(RXER/PHYAD0)
NetR42_1: R42.1 U7.24(RBIAS)

### Notes on the sheet
- LAN8720A
- RXD0/MODE0
- init_config
- level
- High
- All capable. Auto-negotiation enabled. Refer to LAN8720 datasheet
- Description
- CRS_DV/MODE2
- RXD1/MODE1
- RXER/PHYAD0
- Low
- Refer to LAN8720 datasheet
- LED1/REGOFF
- LED2/nINTSEL
- Select 50MHz external clock
- Enable 1.2V internal regulator
- (in symbol My Title 0) Title:; Size:; Document Number:; Rev:; Draw By:; Date:; Sheet:; of

### Library data of the parts
B4 L1 = Inductor PWR-SMD
C38-C46 C48 C50 = C_Generic: as C51 on sheet 8) Power Supply,Config
C47 C49 = C_Generic: Toler.: 10%; P/N #1: C0603C104K4RAC; Voltage: 16V; Mfg #1: KEMET; Dielectric: X7R; 封装: 0805; 类型: 贴片陶瓷电容
R25-R45 = R_Generic_Dup2
R46 R47 = R_Generic: P/N #3: CR10-103J-T; Toler.: 1%; Watts: 0.1W; P/N #1: RK73H1JT1002F; Mfg #1: KOA SPEER; Mfg #3: AVX
TP1 = TestPoint-HOLE
U7 = LAN8720 QFN24: PART#: SMSC LAN8720A-CP
U8 = RT8008-PB
Y3 = DSX321G_0
*#3 = My Title 0: WebSite: http://www.ucdragon.cn; Page Create Date: May 29, 2006

## Sheet 6) Nand Flash,NOR Flash.SchDoc
size 420 x 297 mm
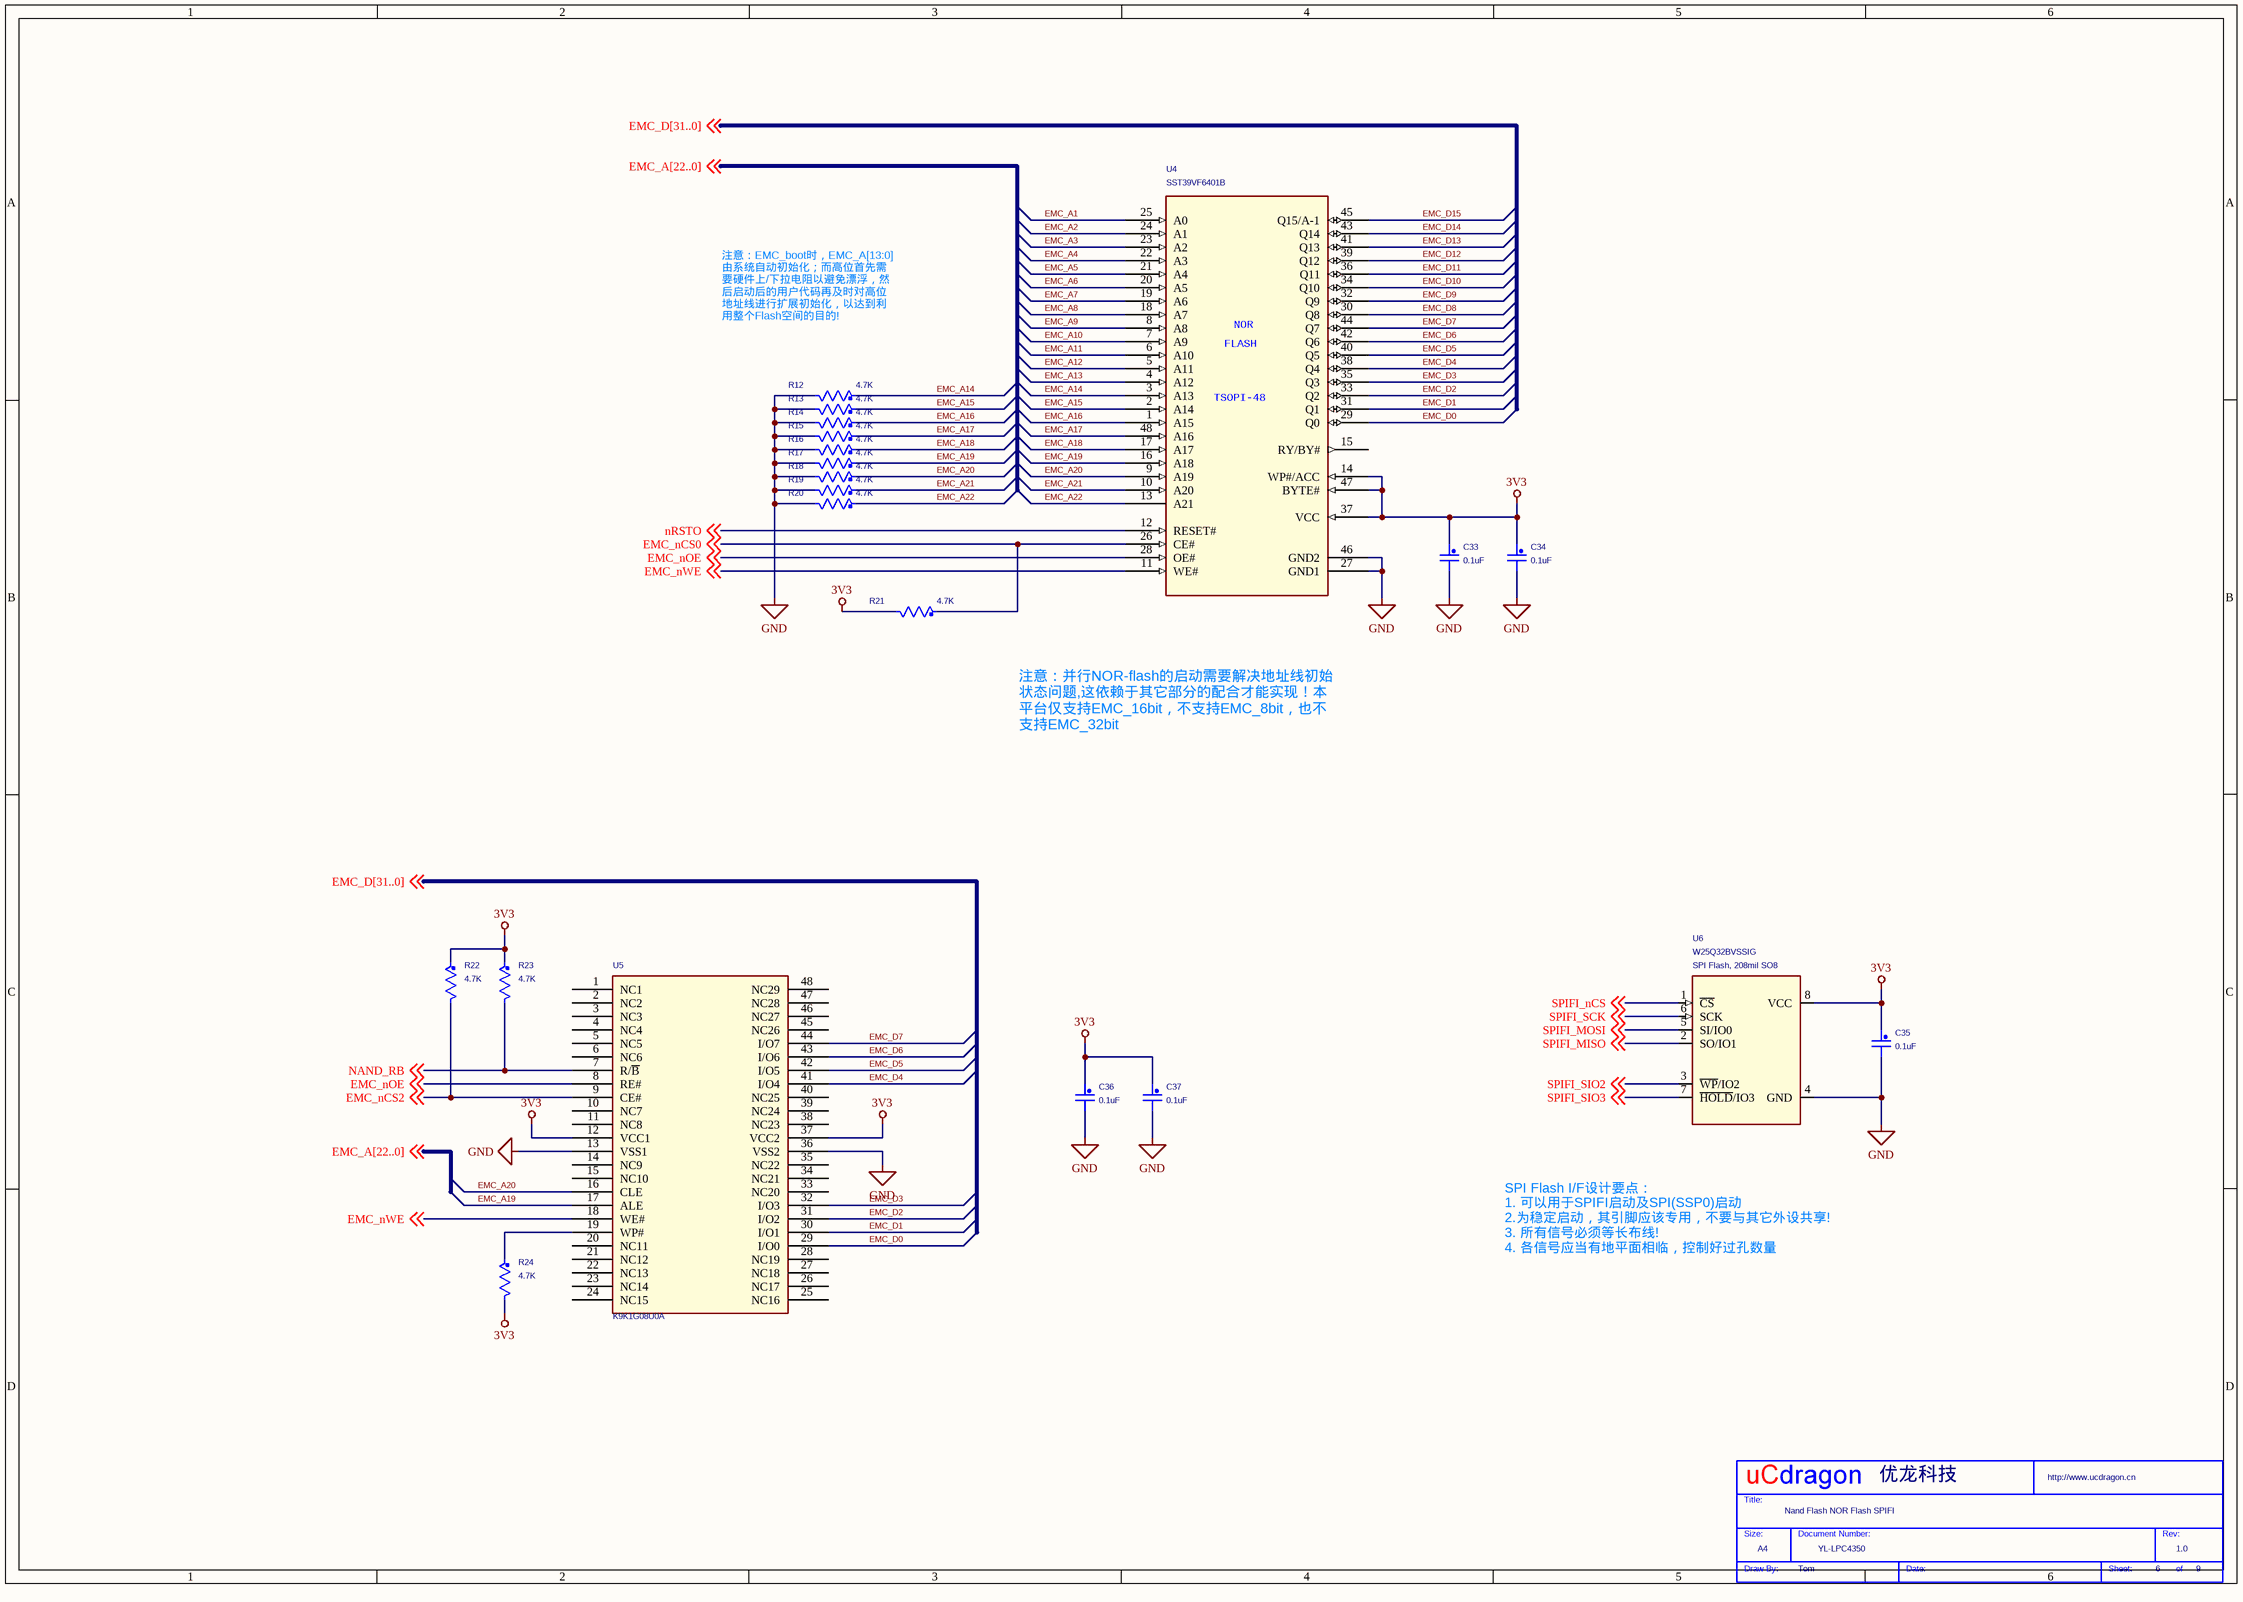
[diagram p3: 6) Nand Flash,NOR Flash.SchDoc]

### Parts
(Parts that share a designator on the sheet are numbered #1, #2 ... from top to bottom, then left to right.)
*#4  Company: 优龙科技  Drawing: Tom  Doc: YL-LPC4350  RevCode: 1.0  Title: Nand Flash NOR Flash SPIFI  Page Size: A4  Page Number: 6  Page Count: 9  (hidden comment: My Title 0)  (graphical)
C33  0.1uF  [CAP0805]
C34  0.1uF  [CAP0805]
C35  0.1uF  [CAP0805]
C36  0.1uF  [CAP0805]
C37  0.1uF  [CAP0805]
R12  4.7K  [R0603]
R13  4.7K  [R0603]
R14  4.7K  [R0603]
R15  4.7K  [R0603]
R16  4.7K  [R0603]
R17  4.7K  [R0603]
R18  4.7K  [R0603]
R19  4.7K  [R0603]
R20  4.7K  [R0603]
R21  4.7K  [R0603]
R22  4.7K  [R0603]
R23  4.7K  [R0603]
R24  4.7K  [R0603]
U4  SST39VF6401B  [TSOPI-48]
U5  K9K1G08U0A  [TSOP1]
U6  W25Q32BVSSIG  Note: SPI Flash, 208mil SO8  [W25Q32_SO8_208MIL]

### Nets
3V3: C33.1 C34.1 C35.1 C36.1 C37.1 R21.2 R22.1 R23.1 R24.2 U4.14(WP#/ACC) U4.37(VCC) U4.47(BYTE#) U5.12(VCC1) U5.37(VCC2) U6.8(VCC)
GND: C33.2 C34.2 C35.2 C36.2 C37.2 R12.2 R13.2 R14.2 R15.2 R16.2 R17.2 R18.2 R19.2 R20.2 U4.27(GND1) U4.46(GND2) U5.13(VSS1) U5.36(VSS2) U6.4(GND)
EMC_A1: U4.25(A0)
EMC_A2: U4.24(A1)
EMC_A3: U4.23(A2)
EMC_A4: U4.22(A3)
EMC_A5: U4.21(A4)
EMC_A6: U4.20(A5)
EMC_A7: U4.19(A6)
EMC_A8: U4.18(A7)
EMC_A9: U4.8(A8)
EMC_A10: U4.7(A9)
EMC_A11: U4.6(A10)
EMC_A12: U4.5(A11)
EMC_A13: U4.4(A12)
EMC_A14: R12.1 U4.3(A13)
EMC_A15: R13.1 U4.2(A14)
EMC_A16: R14.1 U4.1(A15)
EMC_A17: R15.1 U4.48(A16)
EMC_A18: R16.1 U4.17(A17)
EMC_A19: R17.1 U4.16(A18) U5.17(ALE)
EMC_A20: R18.1 U4.9(A19) U5.16(CLE)
EMC_A21: R19.1 U4.10(A20)
EMC_A22: R20.1 U4.13(A21)
EMC_D0: U4.29(Q0) U5.29(I/O0)
EMC_D1: U4.31(Q1) U5.30(I/O1)
EMC_D2: U4.33(Q2) U5.31(I/O2)
EMC_D3: U4.35(Q3) U5.32(I/O3)
EMC_D4: U4.38(Q4) U5.41(I/O4)
EMC_D5: U4.40(Q5) U5.42(I/O5)
EMC_D6: U4.42(Q6) U5.43(I/O6)
EMC_D7: U4.44(Q7) U5.44(I/O7)
EMC_D8: U4.30(Q8)
EMC_D9: U4.32(Q9)
EMC_D10: U4.34(Q10)
EMC_D11: U4.36(Q11)
EMC_D12: U4.39(Q12)
EMC_D13: U4.41(Q13)
EMC_D14: U4.43(Q14)
EMC_D15: U4.45(Q15/A-1)
EMC_nCS0: R21.1 U4.26(CE#) ; off-sheet EMC_nCS0
EMC_nCS2: R22.2 U5.9(CE#) ; off-sheet EMC_nCS2
EMC_nOE: U4.28(OE#) U5.8(RE#) ; off-sheet EMC_nOE
EMC_nWE: U4.11(WE#) U5.18(WE#) ; off-sheet EMC_nWE
NAND_RB: R23.2 U5.7(R/~{B}) ; off-sheet NAND_RB
nRSTO: U4.12(RESET#) ; off-sheet nRSTO
SPIFI_MISO: U6.2(SO/IO1) ; off-sheet SPIFI_MISO
SPIFI_MOSI: U6.5(SI/IO0) ; off-sheet SPIFI_MOSI
SPIFI_nCS: U6.1(~{CS}) ; off-sheet SPIFI_nCS
SPIFI_SCK: U6.6(SCK) ; off-sheet SPIFI_SCK
SPIFI_SIO2: U6.3(~{WP}/IO2) ; off-sheet SPIFI_SIO2
SPIFI_SIO3: U6.7(~{HOLD}/IO3) ; off-sheet SPIFI_SIO3
NetR24_1: R24.1 U5.19(WP#)

Not connected (* = marked no-connect by the designer): U4 15(RY/BY#); U5 1(NC1) 2(NC2) 3(NC3) 4(NC4) 5(NC5) 6(NC6) 10(NC7) 11(NC8) 14(NC9) 15(NC10) 20(NC11) 21(NC12) 22(NC13) 23(NC14) 24(NC15) 25(NC16) 26(NC17) 27(NC18) 28(NC19) 33(NC20) 34(NC21) 35(NC22) 38(NC23) 39(NC24) 40(NC25) 45(NC26) 46(NC27) 47(NC28) 48(NC29)

### Notes on the sheet
- 注意：EMC_boot时，EMC_A[13:0]
  由系统自动初始化；而高位首先需
  要硬件上/下拉电阻以避免漂浮，然
  后启动后的用户代码再及时对高位
  地址线进行扩展初始化，以达到利
  用整个Flash空间的目的!
- 注意：并行NOR-flash的启动需要解决地址线初始
  状态问题,这依赖于其它部分的配合才能实现！本
  平台仅支持EMC_16bit，不支持EMC_8bit，也不
  支持EMC_32bit
- SPI Flash I/F设计要点：
  1. 可以用于SPIFI启动及SPI(SSP0)启动
  2.为稳定启动，其引脚应该专用，不要与其它外设共享!
  3. 所有信号必须等长布线!
  4. 各信号应当有地平面相临，控制好过孔数量
- (in symbol MX29LV640EBTI-70G) NOR; FLASH; TSOPI-48
- (in symbol My Title 0) Title:; Size:; Document Number:; Rev:; Draw By:; Date:; Sheet:; of

### Library data of the parts
C33-C37 = C_Generic: as C51 on sheet 8) Power Supply,Config
R12-R24 = R_Generic_Dup1: Mfg #1: KOA SPEER; P/N #1: RK73H1JT1002F; Watts: 0.1W; Toler.: 1%; P/N #3: CR10-103J-T; Mfg #3: AVX
U4 = MX29LV640EBTI-70G
U6 = SPI FLASH 4IO WSO8
*#4 = My Title 0: WebSite: http://www.ucdragon.cn; Page Create Date: May 29, 2006

## Sheet 5) 64MB SDRAM.SchDoc
size 420 x 297 mm
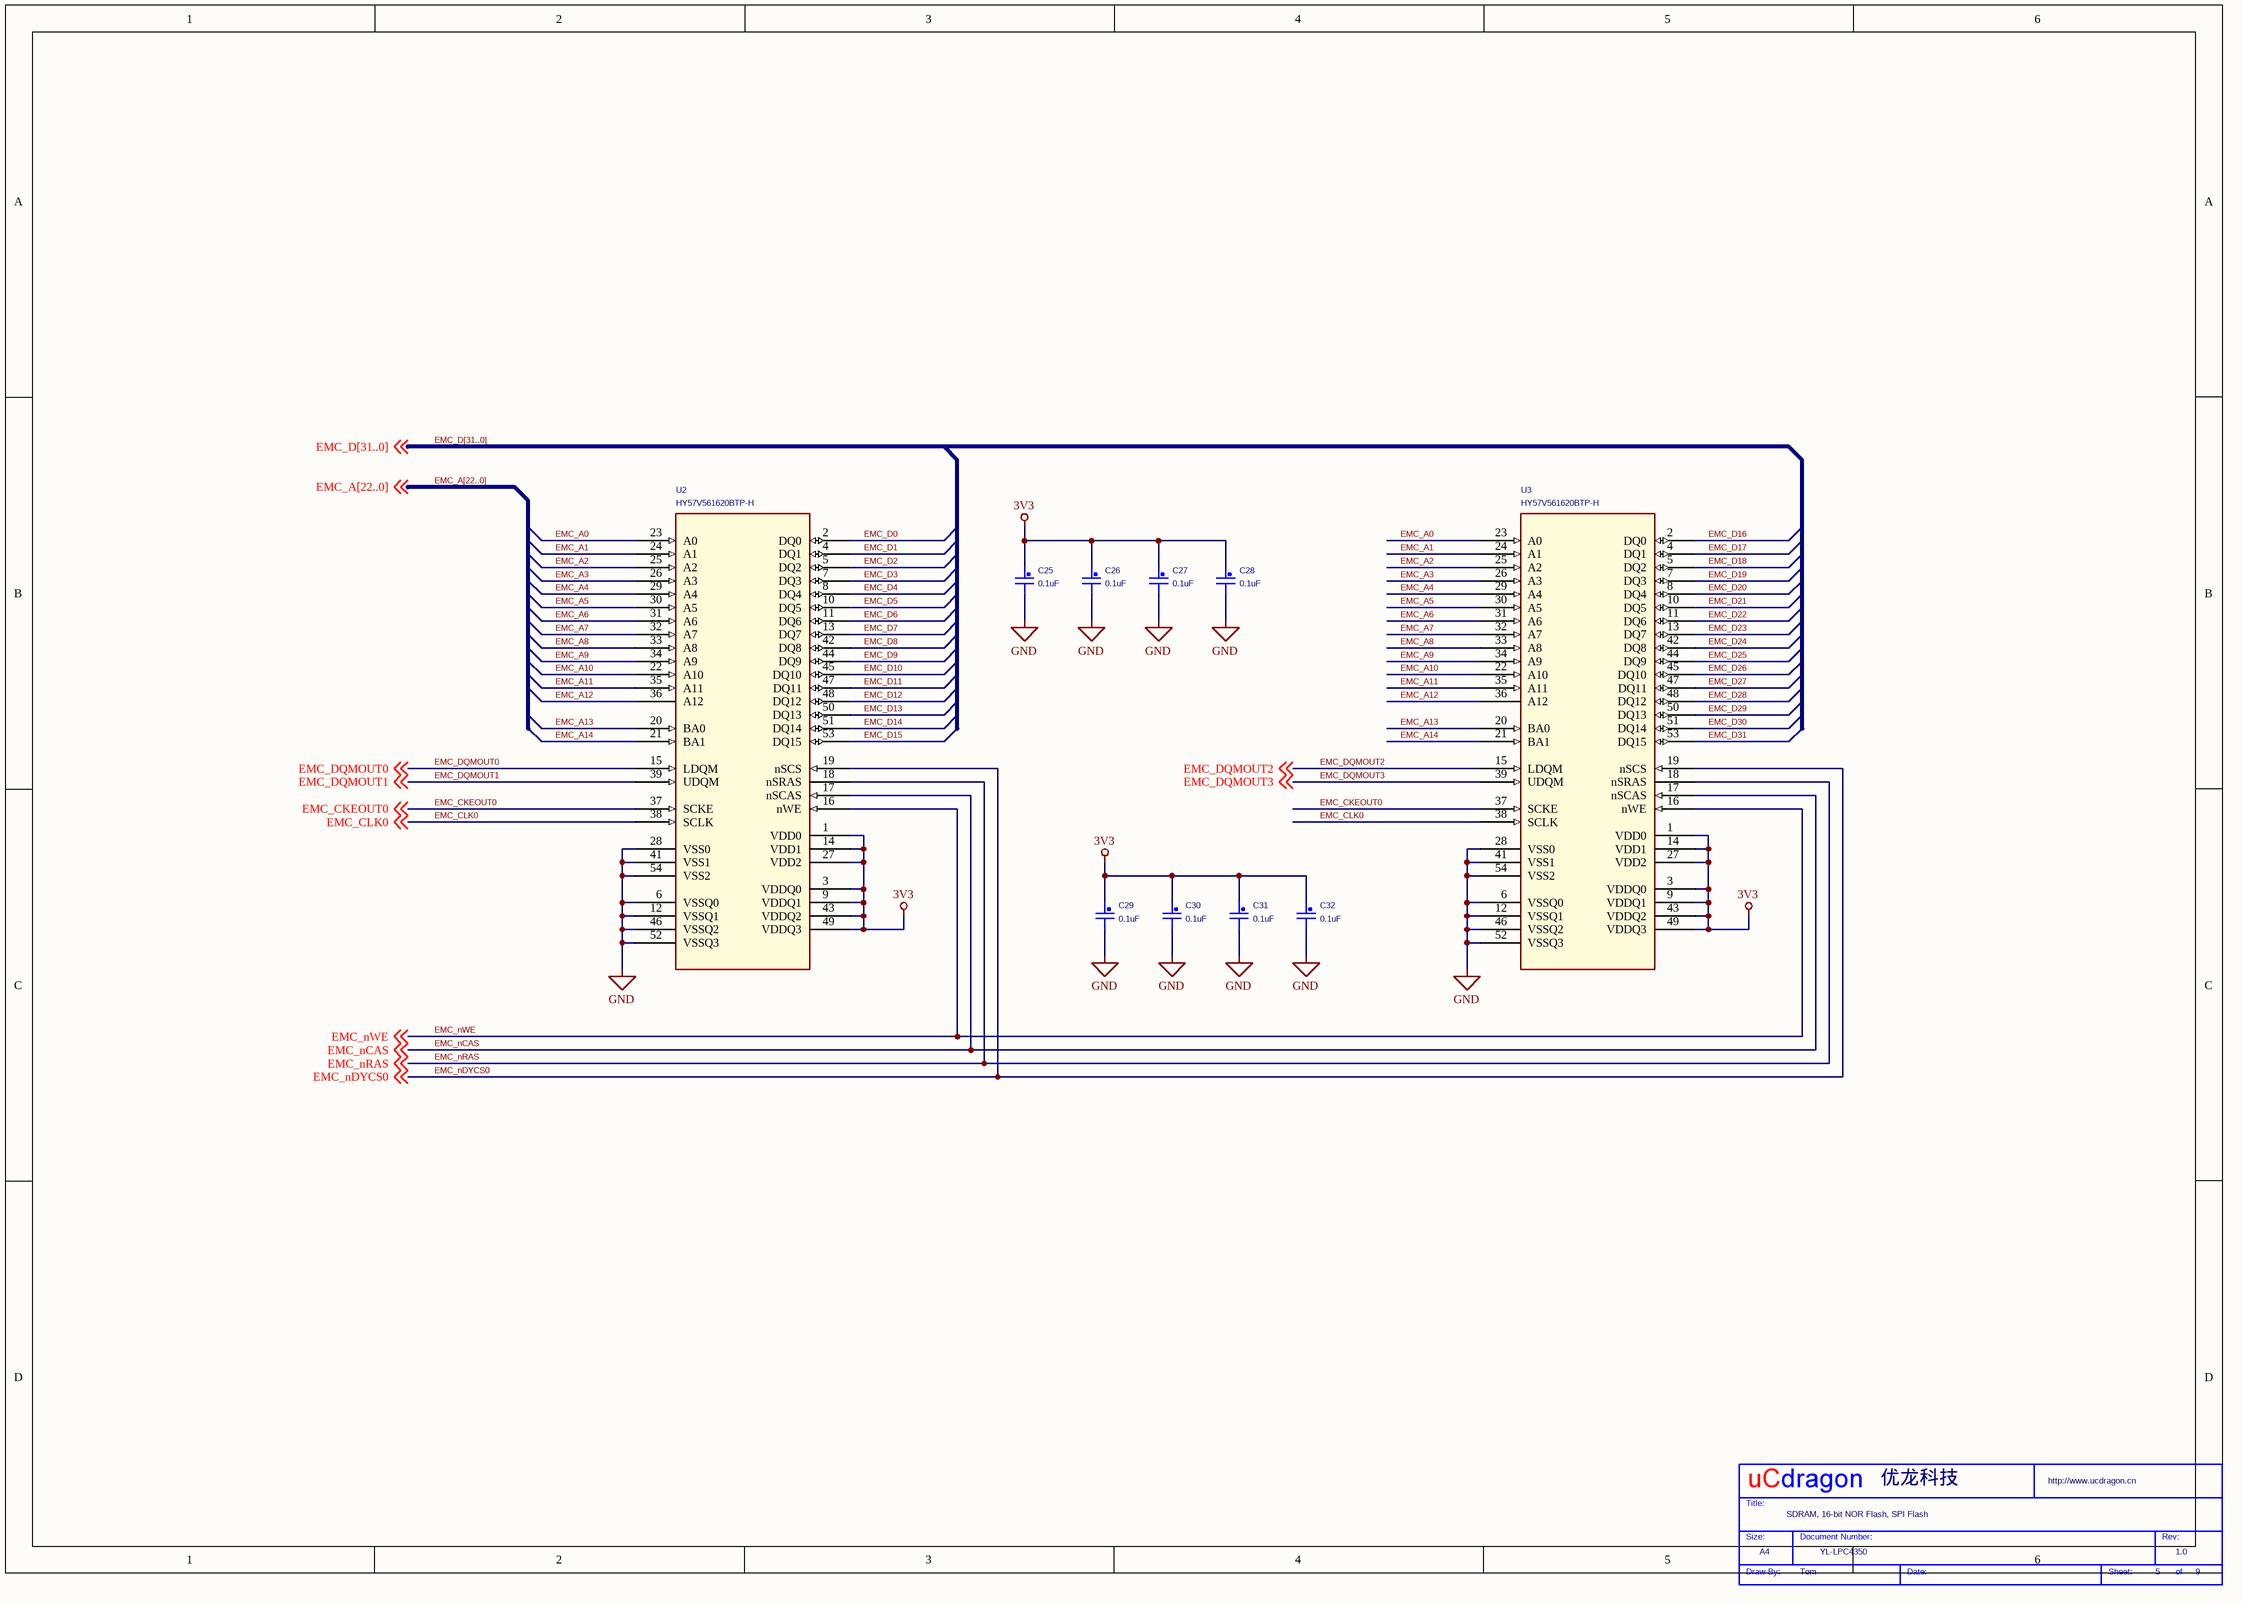
[diagram p4: 5) 64MB SDRAM.SchDoc]

### Parts
(Parts that share a designator on the sheet are numbered #1, #2 ... from top to bottom, then left to right.)
*#5  Company: 优龙科技  Drawing: Tom  Doc: YL-LPC4350  RevCode: 1.0  Title: SDRAM, 16-bit NOR Flash, SPI Flash  Page Size: A4  Page Number: 5  Page Count: 9  (hidden comment: My Title 0)  (graphical)
C25  0.1uF  [CAP0805]
C26  0.1uF  [CAP0805]
C27  0.1uF  [CAP0805]
C28  0.1uF  [CAP0805]
C29  0.1uF  [CAP0805]
C30  0.1uF  [CAP0805]
C31  0.1uF  [CAP0805]
C32  0.1uF  [CAP0805]
U2  HY57V561620BTP-H  [K4S561632E-TSOP54]
U3  HY57V561620BTP-H  [K4S561632E-TSOP54]

### Nets
3V3: C25.1 C26.1 C27.1 C28.1 C29.1 C30.1 C31.1 C32.1 U2.1(VDD0) U2.3(VDDQ0) U2.9(VDDQ1) U2.14(VDD1) U2.27(VDD2) U2.43(VDDQ2) U2.49(VDDQ3) U3.1(VDD0) U3.3(VDDQ0) U3.9(VDDQ1) U3.14(VDD1) U3.27(VDD2) U3.43(VDDQ2) U3.49(VDDQ3)
GND: C25.2 C26.2 C27.2 C28.2 C29.2 C30.2 C31.2 C32.2 U2.6(VSSQ0) U2.12(VSSQ1) U2.28(VSS0) U2.41(VSS1) U2.46(VSSQ2) U2.52(VSSQ3) U2.54(VSS2) U3.6(VSSQ0) U3.12(VSSQ1) U3.28(VSS0) U3.41(VSS1) U3.46(VSSQ2) U3.52(VSSQ3) U3.54(VSS2)
EMC_A0: U2.23(A0) U3.23(A0)
EMC_A1: U2.24(A1) U3.24(A1)
EMC_A2: U2.25(A2) U3.25(A2)
EMC_A3: U2.26(A3) U3.26(A3)
EMC_A4: U2.29(A4) U3.29(A4)
EMC_A5: U2.30(A5) U3.30(A5)
EMC_A6: U2.31(A6) U3.31(A6)
EMC_A7: U2.32(A7) U3.32(A7)
EMC_A8: U2.33(A8) U3.33(A8)
EMC_A9: U2.34(A9) U3.34(A9)
EMC_A10: U2.22(A10) U3.22(A10)
EMC_A11: U2.35(A11) U3.35(A11)
EMC_A12: U2.36(A12) U3.36(A12)
EMC_A13: U2.20(BA0) U3.20(BA0)
EMC_A14: U2.21(BA1) U3.21(BA1)
EMC_CKEOUT0: U2.37(SCKE) U3.37(SCKE) ; off-sheet EMC_CKEOUT0
EMC_CLK0: U2.38(SCLK) U3.38(SCLK) ; off-sheet EMC_CLK0
EMC_D0: U2.2(DQ0)
EMC_D1: U2.4(DQ1)
EMC_D2: U2.5(DQ2)
EMC_D3: U2.7(DQ3)
EMC_D4: U2.8(DQ4)
EMC_D5: U2.10(DQ5)
EMC_D6: U2.11(DQ6)
EMC_D7: U2.13(DQ7)
EMC_D8: U2.42(DQ8)
EMC_D9: U2.44(DQ9)
EMC_D10: U2.45(DQ10)
EMC_D11: U2.47(DQ11)
EMC_D12: U2.48(DQ12)
EMC_D13: U2.50(DQ13)
EMC_D14: U2.51(DQ14)
EMC_D15: U2.53(DQ15)
EMC_D16: U3.2(DQ0)
EMC_D17: U3.4(DQ1)
EMC_D18: U3.5(DQ2)
EMC_D19: U3.7(DQ3)
EMC_D20: U3.8(DQ4)
EMC_D21: U3.10(DQ5)
EMC_D22: U3.11(DQ6)
EMC_D23: U3.13(DQ7)
EMC_D24: U3.42(DQ8)
EMC_D25: U3.44(DQ9)
EMC_D26: U3.45(DQ10)
EMC_D27: U3.47(DQ11)
EMC_D28: U3.48(DQ12)
EMC_D29: U3.50(DQ13)
EMC_D30: U3.51(DQ14)
EMC_D31: U3.53(DQ15)
EMC_DQMOUT0: U2.15(LDQM) ; off-sheet EMC_DQMOUT0
EMC_DQMOUT1: U2.39(UDQM) ; off-sheet EMC_DQMOUT1
EMC_DQMOUT2: U3.15(LDQM) ; off-sheet EMC_DQMOUT2
EMC_DQMOUT3: U3.39(UDQM) ; off-sheet EMC_DQMOUT3
EMC_nCAS: U2.17(nSCAS) U3.17(nSCAS) ; off-sheet EMC_nCAS
EMC_nDYCS0: U2.19(nSCS) U3.19(nSCS) ; off-sheet EMC_nDYCS0
EMC_nRAS: U2.18(nSRAS) U3.18(nSRAS) ; off-sheet EMC_nRAS
EMC_nWE: U2.16(nWE) U3.16(nWE) ; off-sheet EMC_nWE

### Buses and harness runs
bus EMC_A[22..0]
bus EMC_D[31..0]

### Notes on the sheet
- (in symbol My Title 0) Title:; Size:; Document Number:; Rev:; Draw By:; Date:; Sheet:; of

### Library data of the parts
C25-C32 = C_Generic: as C51 on sheet 8) Power Supply,Config
U2 U3 = K4S561632C
*#5 = My Title 0: WebSite: http://www.ucdragon.cn; Page Create Date: May 29, 2006

## Nets that join several sheets
3V3: 8) Power Supply,Config (13 pins), 6) Nand Flash,NOR Flash (15 pins), 5) 64MB SDRAM (22 pins)
E_GND: 9) Connector (CN1.180), 7) EMAC (17 pins)
GND: 9) Connector (5 pins), 8) Power Supply,Config (16 pins), 7) EMAC (6 pins), 6) Nand Flash,NOR Flash (19 pins), 5) 64MB SDRAM (22 pins)
VIN_5V: 9) Connector (CN1.148 CN1.150), 8) Power Supply,Config (C51.1 CT1.1 U9.3), 7) EMAC (C47.1 U8.1 U8.4)
EMC_A0: 9) Connector (CN1.85), 5) 64MB SDRAM (U2.23 U3.23)
EMC_A1: 9) Connector (CN1.87), 6) Nand Flash,NOR Flash (U4.25), 5) 64MB SDRAM (U2.24 U3.24)
EMC_A2: 9) Connector (CN1.89), 6) Nand Flash,NOR Flash (U4.24), 5) 64MB SDRAM (U2.25 U3.25)
EMC_A3: 9) Connector (CN1.91), 6) Nand Flash,NOR Flash (U4.23), 5) 64MB SDRAM (U2.26 U3.26)
EMC_A4: 9) Connector (CN1.93), 6) Nand Flash,NOR Flash (U4.22), 5) 64MB SDRAM (U2.29 U3.29)
EMC_A5: 9) Connector (CN1.95), 6) Nand Flash,NOR Flash (U4.21), 5) 64MB SDRAM (U2.30 U3.30)
EMC_A6: 9) Connector (CN1.97), 6) Nand Flash,NOR Flash (U4.20), 5) 64MB SDRAM (U2.31 U3.31)
EMC_A7: 9) Connector (CN1.99), 6) Nand Flash,NOR Flash (U4.19), 5) 64MB SDRAM (U2.32 U3.32)
EMC_A8: 9) Connector (CN1.86), 6) Nand Flash,NOR Flash (U4.18), 5) 64MB SDRAM (U2.33 U3.33)
EMC_A9: 9) Connector (CN1.88), 6) Nand Flash,NOR Flash (U4.8), 5) 64MB SDRAM (U2.34 U3.34)
EMC_A10: 9) Connector (CN1.90), 6) Nand Flash,NOR Flash (U4.7), 5) 64MB SDRAM (U2.22 U3.22)
EMC_A11: 9) Connector (CN1.92), 6) Nand Flash,NOR Flash (U4.6), 5) 64MB SDRAM (U2.35 U3.35)
EMC_A12: 9) Connector (CN1.94), 6) Nand Flash,NOR Flash (U4.5), 5) 64MB SDRAM (U2.36 U3.36)
EMC_A13: 9) Connector (CN1.96), 6) Nand Flash,NOR Flash (U4.4), 5) 64MB SDRAM (U2.20 U3.20)
EMC_A14: 9) Connector (CN1.98), 6) Nand Flash,NOR Flash (R12.1 U4.3), 5) 64MB SDRAM (U2.21 U3.21)
EMC_A15: 9) Connector (CN1.100), 6) Nand Flash,NOR Flash (R13.1 U4.2)
EMC_A16: 9) Connector (CN1.37), 6) Nand Flash,NOR Flash (R14.1 U4.1)
EMC_A17: 9) Connector (CN1.39), 6) Nand Flash,NOR Flash (R15.1 U4.48)
EMC_A18: 9) Connector (CN1.41), 6) Nand Flash,NOR Flash (R16.1 U4.17)
EMC_A19: 9) Connector (CN1.43), 6) Nand Flash,NOR Flash (R17.1 U4.16 U5.17)
EMC_A20: 9) Connector (CN1.45), 6) Nand Flash,NOR Flash (R18.1 U4.9 U5.16)
EMC_A21: 9) Connector (CN1.47), 6) Nand Flash,NOR Flash (R19.1 U4.10)
EMC_A22: 9) Connector (CN1.49), 6) Nand Flash,NOR Flash (R20.1 U4.13)
EMC_D0: 9) Connector (CN1.51), 6) Nand Flash,NOR Flash (U4.29 U5.29), 5) 64MB SDRAM (U2.2)
EMC_D1: 9) Connector (CN1.53), 6) Nand Flash,NOR Flash (U4.31 U5.30), 5) 64MB SDRAM (U2.4)
EMC_D2: 9) Connector (CN1.55), 6) Nand Flash,NOR Flash (U4.33 U5.31), 5) 64MB SDRAM (U2.5)
EMC_D3: 9) Connector (CN1.57), 6) Nand Flash,NOR Flash (U4.35 U5.32), 5) 64MB SDRAM (U2.7)
EMC_D4: 9) Connector (CN1.59), 6) Nand Flash,NOR Flash (U4.38 U5.41), 5) 64MB SDRAM (U2.8)
EMC_D5: 9) Connector (CN1.61), 6) Nand Flash,NOR Flash (U4.40 U5.42), 5) 64MB SDRAM (U2.10)
EMC_D6: 9) Connector (CN1.63), 6) Nand Flash,NOR Flash (U4.42 U5.43), 5) 64MB SDRAM (U2.11)
EMC_D7: 9) Connector (CN1.65), 6) Nand Flash,NOR Flash (U4.44 U5.44), 5) 64MB SDRAM (U2.13)
EMC_D8: 9) Connector (CN1.67), 6) Nand Flash,NOR Flash (U4.30), 5) 64MB SDRAM (U2.42)
EMC_D9: 9) Connector (CN1.69), 6) Nand Flash,NOR Flash (U4.32), 5) 64MB SDRAM (U2.44)
EMC_D10: 9) Connector (CN1.71), 6) Nand Flash,NOR Flash (U4.34), 5) 64MB SDRAM (U2.45)
EMC_D11: 9) Connector (CN1.73), 6) Nand Flash,NOR Flash (U4.36), 5) 64MB SDRAM (U2.47)
EMC_D12: 9) Connector (CN1.75), 6) Nand Flash,NOR Flash (U4.39), 5) 64MB SDRAM (U2.48)
EMC_D13: 9) Connector (CN1.77), 6) Nand Flash,NOR Flash (U4.41), 5) 64MB SDRAM (U2.50)
EMC_D14: 9) Connector (CN1.79), 6) Nand Flash,NOR Flash (U4.43), 5) 64MB SDRAM (U2.51)
EMC_D15: 9) Connector (CN1.81), 6) Nand Flash,NOR Flash (U4.45), 5) 64MB SDRAM (U2.53)
EMC_D16: 9) Connector (CN1.52), 5) 64MB SDRAM (U3.2)
EMC_D17: 9) Connector (CN1.54), 5) 64MB SDRAM (U3.4)
EMC_D18: 9) Connector (CN1.56), 5) 64MB SDRAM (U3.5)
EMC_D19: 9) Connector (CN1.58), 5) 64MB SDRAM (U3.7)
EMC_D20: 9) Connector (CN1.60), 5) 64MB SDRAM (U3.8)
EMC_D21: 9) Connector (CN1.62), 5) 64MB SDRAM (U3.10)
EMC_D22: 9) Connector (CN1.64), 5) 64MB SDRAM (U3.11)
EMC_D23: 9) Connector (CN1.66), 5) 64MB SDRAM (U3.13)
EMC_D24: 9) Connector (CN1.68), 5) 64MB SDRAM (U3.42)
EMC_D25: 9) Connector (CN1.70), 5) 64MB SDRAM (U3.44)
EMC_D26: 9) Connector (CN1.72), 5) 64MB SDRAM (U3.45)
EMC_D27: 9) Connector (CN1.74), 5) 64MB SDRAM (U3.47)
EMC_D28: 9) Connector (CN1.76), 5) 64MB SDRAM (U3.48)
EMC_D29: 9) Connector (CN1.78), 5) 64MB SDRAM (U3.50)
EMC_D30: 9) Connector (CN1.80), 5) 64MB SDRAM (U3.51)
EMC_D31: 9) Connector (CN1.82), 5) 64MB SDRAM (U3.53)
EMC_nOE: 9) Connector (CN1.40), 6) Nand Flash,NOR Flash (U4.28 U5.8)
EMC_nWE: 9) Connector (CN1.42), 6) Nand Flash,NOR Flash (U4.11 U5.18), 5) 64MB SDRAM (U2.16 U3.16)
ETN_VDDA: 9) Connector (CN1.186), 7) EMAC (R25.2)
LED1_REGOFF: 9) Connector (CN1.184), 7) EMAC (R44.1 U7.3)
LED2_nINTSEL: 9) Connector (CN1.182), 7) EMAC (R43.1 U7.2)
nRSTO: 9) Connector (CN1.50), 8) Power Supply,Config (U10.11), 7) EMAC (U7.15), 6) Nand Flash,NOR Flash (U4.12)
nTRST: 9) Connector (CN1.170), 8) Power Supply,Config (R50.2 U10.6)
Reset_In: 9) Connector (CN1.48), 8) Power Supply,Config (R51.2 U11.3)
RXN: 9) Connector (CN1.194), 7) EMAC (R29.2 U7.22)
RXP: 9) Connector (CN1.192), 7) EMAC (R28.2 U7.23)
SPIFI_MISO: 9) Connector (CN1.199), 6) Nand Flash,NOR Flash (U6.2)
SPIFI_MOSI: 9) Connector (CN1.200), 6) Nand Flash,NOR Flash (U6.5)
SPIFI_nCS: 9) Connector (CN1.195), 6) Nand Flash,NOR Flash (U6.1)
SPIFI_SCK: 9) Connector (CN1.197), 6) Nand Flash,NOR Flash (U6.6)
SPIFI_SIO2: 9) Connector (CN1.198), 6) Nand Flash,NOR Flash (U6.3)
SPIFI_SIO3: 9) Connector (CN1.196), 6) Nand Flash,NOR Flash (U6.7)
TXN: 9) Connector (CN1.190), 7) EMAC (R27.2 U7.20)
TXP: 9) Connector (CN1.188), 7) EMAC (R26.2 U7.21)